# Altium project ESP32_P4_M3.PrjPcb (part 1 of 2)
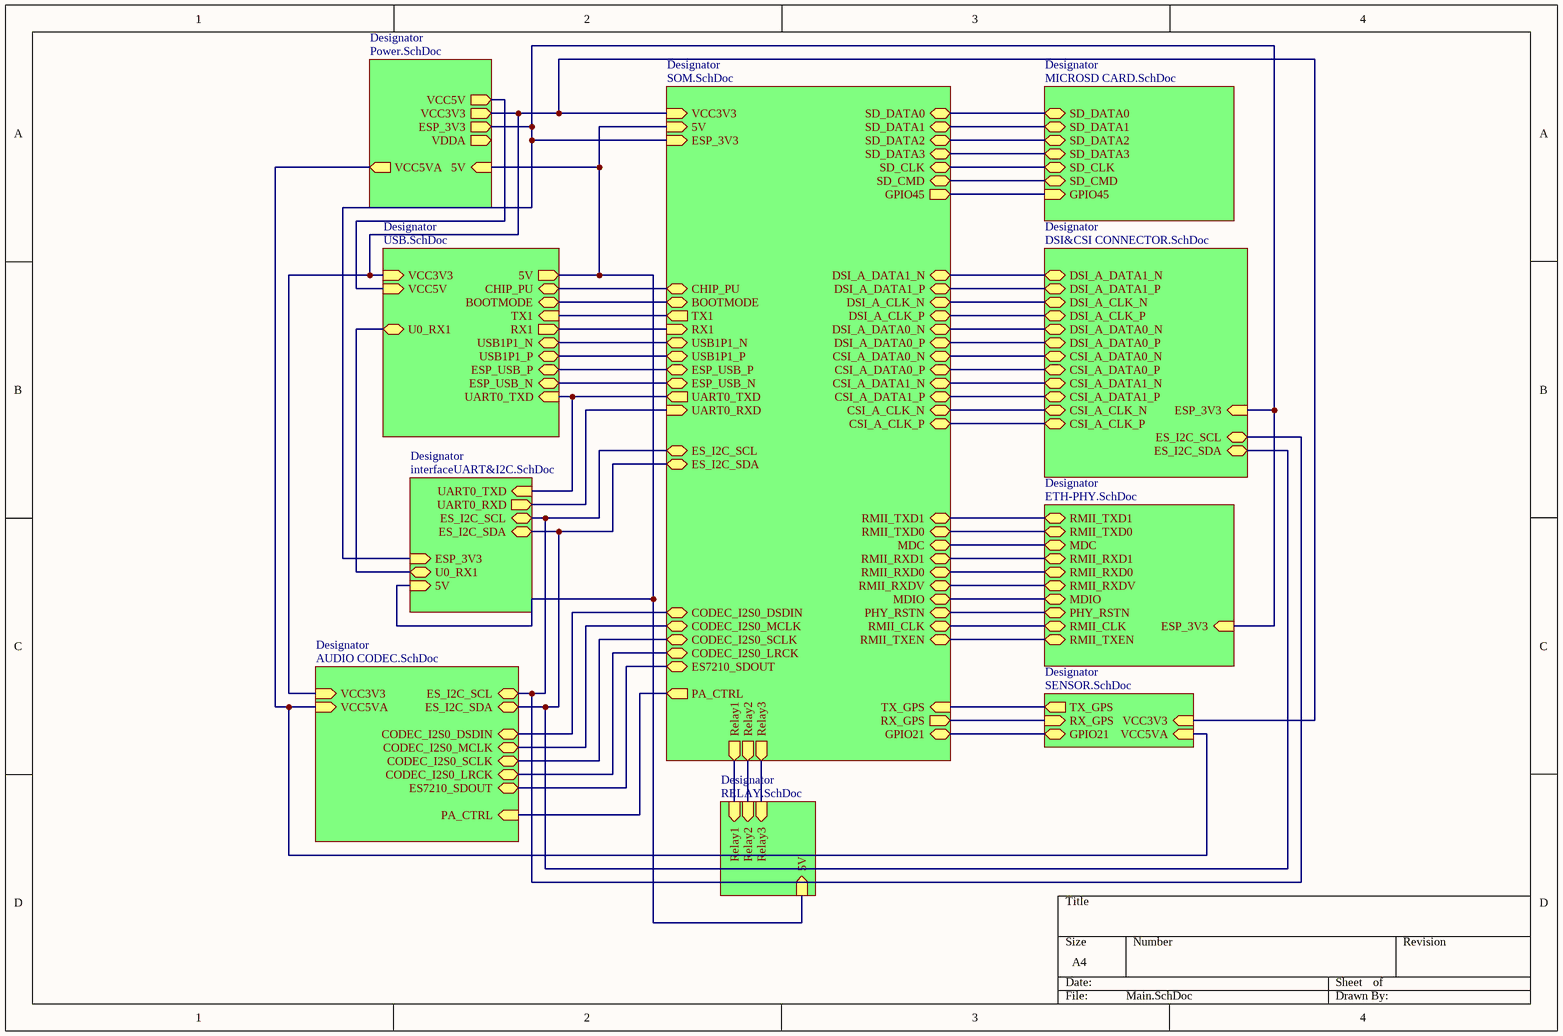
[diagram p0: Main.SchDoc]
11 sheets, 293 parts. Net scope: hierarchical (ports join the sheet entries above them; power ports are global).
Board file: ESP32_P4_M3.PcbDoc
Sheets:
  Main.SchDoc
    Designator = Power.SchDoc
    Designator = interfaceUART&I2C.SchDoc
    Designator = AUDIO CODEC.SchDoc
    Designator = MICROSD CARD.SchDoc
    Designator = USB.SchDoc
    Designator = DSI&CSI CONNECTOR.SchDoc
    Designator = ETH-PHY.SchDoc
    Designator = SOM.SchDoc
    Designator = SENSOR.SchDoc
    Designator = RELAY.SchDoc

## Sheet Main.SchDoc
size A4; Author: Qquoc; CompanyName: VKU; DrawnBy: Qquoc; Address1: AN NHƠN-BÌNH ĐỊNH; Revision: V1.0; SheetNumber: 1; SheetTotal: 11

### Sub-sheets
Designator = Power.SchDoc: VCC5V (out), VCC3V3 (out), ESP_3V3 (out), VDDA (out), VCC5VA (out), 5V (in)
Designator = interfaceUART&I2C.SchDoc: ESP_3V3 (in), UART0_TXD (in), UART0_RXD (out), ES_I2C_SCL (bidir), ES_I2C_SDA (bidir), U0_RX1 (bidir), 5V (in)
Designator = AUDIO CODEC.SchDoc: VCC5VA (in), PA_CTRL (in), CODEC_I2S0_SCLK (bidir), ES7210_SDOUT (bidir), CODEC_I2S0_LRCK (bidir), CODEC_I2S0_DSDIN (bidir), ES_I2C_SDA (bidir), ES_I2C_SCL (bidir), VCC3V3 (in), CODEC_I2S0_MCLK (bidir)
Designator = MICROSD CARD.SchDoc: GPIO45 (in), SD_DATA2 (bidir), SD_DATA3 (bidir), SD_CLK (bidir), SD_DATA0 (bidir), SD_DATA1 (bidir), SD_CMD (bidir)
Designator = USB.SchDoc: VCC3V3 (in), VCC5V (in), 5V (out), CHIP_PU (bidir), BOOTMODE (bidir), RX1 (out), TX1 (in), USB1P1_N (bidir), USB1P1_P (bidir), ESP_USB_P (bidir), ESP_USB_N (bidir), U0_RX1 (bidir), UART0_TXD (in)
Designator = DSI&CSI CONNECTOR.SchDoc: ES_I2C_SCL (bidir), ES_I2C_SDA (bidir), DSI_A_DATA1_N (bidir), DSI_A_DATA1_P (bidir), DSI_A_CLK_N (bidir), DSI_A_CLK_P (bidir), DSI_A_DATA0_N (bidir), DSI_A_DATA0_P (bidir), ESP_3V3 (in), CSI_A_DATA0_N (bidir), CSI_A_DATA0_P (bidir), CSI_A_DATA1_N (bidir), CSI_A_DATA1_P (bidir), CSI_A_CLK_N (bidir), CSI_A_CLK_P (bidir)
Designator = ETH-PHY.SchDoc: ESP_3V3 (in), RMII_TXEN (bidir), RMII_TXD0 (bidir), RMII_CLK (bidir), RMII_RXDV (bidir), RMII_RXD0 (bidir), RMII_RXD1 (bidir), MDC (bidir), PHY_RSTN (bidir), MDIO (bidir), RMII_TXD1 (bidir)
Designator = SOM.SchDoc: VCC3V3 (in), CHIP_PU (bidir), 5V (in), SD_DATA2 (bidir), SD_DATA3 (bidir), SD_CLK (bidir), SD_CMD (bidir), GPIO45 (out), SD_DATA1 (bidir), SD_DATA0 (bidir), UART0_RXD (in), UART0_TXD (out), BOOTMODE (bidir), RX1 (in), TX1 (out), USB1P1_P (bidir), USB1P1_N (bidir), ESP_USB_P (bidir), ESP_USB_N (bidir), CSI_A_DATA1_P (bidir), CSI_A_DATA1_N (bidir), CSI_A_CLK_N (bidir), CSI_A_CLK_P (bidir), CSI_A_DATA0_P (bidir), CSI_A_DATA0_N (bidir), DSI_A_DATA0_P (bidir), DSI_A_CLK_P (bidir), DSI_A_CLK_N (bidir), DSI_A_DATA1_P (bidir), DSI_A_DATA1_N (bidir), PA_CTRL (out), RMII_TXD1 (bidir), RMII_TXD0 (bidir), MDC (bidir), RMII_RXD1 (bidir), RMII_RXD0 (bidir), RMII_RXDV (bidir), MDIO (bidir), PHY_RSTN (bidir), RMII_CLK (bidir), RMII_TXEN (bidir), ES7210_SDOUT (bidir), CODEC_I2S0_DSDIN (bidir), CODEC_I2S0_MCLK (bidir), CODEC_I2S0_SCLK (bidir), CODEC_I2S0_LRCK (bidir), ES_I2C_SDA (bidir), ES_I2C_SCL (bidir), ESP_3V3 (in), DSI_A_DATA0_N (bidir), TX_GPS (in), RX_GPS (out), GPIO21 (bidir), Relay1 (out), Relay2 (out), Relay3 (out)
Designator = SENSOR.SchDoc: VCC3V3 (in), RX_GPS (in), TX_GPS (out), VCC5VA (in), GPIO21 (bidir)
Designator = RELAY.SchDoc: Relay1 (in), Relay3 (in), Relay2 (in), 5V (in)

### Nets
5V: sheet Designator/5V, sheet Designator/5V, sheet Designator/5V, sheet Designator/5V, sheet Designator/5V
ESP_3V3: sheet Designator/ESP_3V3, sheet Designator/ESP_3V3, sheet Designator/ESP_3V3, sheet Designator/ESP_3V3, sheet Designator/ESP_3V3
VCC3V3: sheet Designator/VCC3V3, sheet Designator/VDDA, sheet Designator/VCC3V3, sheet Designator/VCC3V3, sheet Designator/VCC3V3, sheet Designator/VCC3V3
VCC5V: sheet Designator/VCC5V, sheet Designator/VCC5V
VCC5VA: sheet Designator/VCC5VA, sheet Designator/VCC5VA, sheet Designator/VCC5VA
BOOTMODE: sheet Designator/BOOTMODE, sheet Designator/RMII_TXD1, sheet Designator/BOOTMODE, sheet Designator/RMII_TXD1
CHIP_PU: sheet Designator/CHIP_PU, sheet Designator/CHIP_PU
CODEC_I2S0_DSDIN: sheet Designator/CODEC_I2S0_DSDIN, sheet Designator/CODEC_I2S0_DSDIN
CODEC_I2S0_LRCK: sheet Designator/CODEC_I2S0_LRCK, sheet Designator/CODEC_I2S0_LRCK
CODEC_I2S0_MCLK: sheet Designator/CODEC_I2S0_MCLK, sheet Designator/CODEC_I2S0_MCLK
CODEC_I2S0_SCLK: sheet Designator/CODEC_I2S0_SCLK, sheet Designator/CODEC_I2S0_SCLK
CSI_A_CLK_N: sheet Designator/CSI_A_CLK_N, sheet Designator/CSI_A_CLK_N
CSI_A_CLK_P: sheet Designator/CSI_A_CLK_P, sheet Designator/CSI_A_CLK_P
CSI_A_DATA0_N: sheet Designator/CSI_A_DATA0_N, sheet Designator/CSI_A_DATA0_N
CSI_A_DATA0_P: sheet Designator/CSI_A_DATA0_P, sheet Designator/CSI_A_DATA0_P
CSI_A_DATA1_N: sheet Designator/CSI_A_DATA1_N, sheet Designator/CSI_A_DATA1_N
CSI_A_DATA1_P: sheet Designator/CSI_A_DATA1_P, sheet Designator/CSI_A_DATA1_P
DSI_A_CLK_N: sheet Designator/DSI_A_CLK_N, sheet Designator/DSI_A_CLK_N
DSI_A_CLK_P: sheet Designator/DSI_A_CLK_P, sheet Designator/DSI_A_CLK_P
DSI_A_DATA0_N: sheet Designator/DSI_A_DATA0_N, sheet Designator/DSI_A_DATA0_N
DSI_A_DATA0_P: sheet Designator/DSI_A_DATA0_P, sheet Designator/DSI_A_DATA0_P
DSI_A_DATA1_N: sheet Designator/DSI_A_DATA1_N, sheet Designator/DSI_A_DATA1_N
DSI_A_DATA1_P: sheet Designator/DSI_A_DATA1_P, sheet Designator/DSI_A_DATA1_P
ES7210_SDOUT: sheet Designator/ES7210_SDOUT, sheet Designator/ES7210_SDOUT
ES_I2C_SCL: sheet Designator/ES_I2C_SCL, sheet Designator/ES_I2C_SCL, sheet Designator/ES_I2C_SCL, sheet Designator/ES_I2C_SCL
ES_I2C_SDA: sheet Designator/ES_I2C_SDA, sheet Designator/ES_I2C_SDA, sheet Designator/ES_I2C_SDA, sheet Designator/ES_I2C_SDA
ESP_USB_N: sheet Designator/ESP_USB_N, sheet Designator/ESP_USB_N
ESP_USB_P: sheet Designator/ESP_USB_P, sheet Designator/ESP_USB_P
GPIO1: sheet Designator/Relay1, sheet Designator/Relay1
GPIO2: sheet Designator/Relay2, sheet Designator/Relay2
GPIO3: sheet Designator/Relay3, sheet Designator/Relay3
GPIO21: sheet Designator/GPIO21, sheet Designator/GPIO21
GPIO22: sheet Designator/TX_GPS, sheet Designator/TX_GPS
GPIO23: sheet Designator/RX_GPS, sheet Designator/RX_GPS
GPIO26: sheet Designator/TX1, sheet Designator/TX1
GPIO27: sheet Designator/RX1, sheet Designator/RX1
GPIO28: sheet Designator/RMII_RXDV, sheet Designator/RMII_RXDV
GPIO29: sheet Designator/RMII_RXD0, sheet Designator/RMII_RXD0
GPIO30: sheet Designator/RMII_RXD1, sheet Designator/RMII_RXD1
GPIO31: sheet Designator/MDC, sheet Designator/MDC
GPIO34: sheet Designator/RMII_TXD0, sheet Designator/RMII_TXD0
GPIO37: sheet Designator/UART0_TXD, sheet Designator/UART0_TXD, sheet Designator/UART0_TXD
GPIO38: sheet Designator/UART0_RXD, sheet Designator/UART0_RXD
GPIO45: sheet Designator/GPIO45, sheet Designator/GPIO45
GPIO49: sheet Designator/RMII_TXEN, sheet Designator/RMII_TXEN
GPIO50: sheet Designator/RMII_CLK, sheet Designator/RMII_CLK
GPIO51: sheet Designator/PHY_RSTN, sheet Designator/PHY_RSTN
GPIO52: sheet Designator/MDIO, sheet Designator/MDIO
SD_CLK: sheet Designator/SD_CLK, sheet Designator/SD_CLK
SD_CMD: sheet Designator/SD_CMD, sheet Designator/SD_CMD
SD_DATA0: sheet Designator/SD_DATA0, sheet Designator/SD_DATA0
SD_DATA1: sheet Designator/SD_DATA1, sheet Designator/SD_DATA1
SD_DATA2: sheet Designator/SD_DATA2, sheet Designator/SD_DATA2
SD_DATA3: sheet Designator/SD_DATA3, sheet Designator/SD_DATA3
U0_RX1: sheet Designator/U0_RX1, sheet Designator/U0_RX1
USB1P1_N: sheet Designator/USB1P1_N, sheet Designator/USB1P1_N
USB1P1_P: sheet Designator/USB1P1_P, sheet Designator/USB1P1_P
NetIC4_1: sheet Designator/PA_CTRL, sheet Designator/PA_CTRL

## Sheet Power.SchDoc
size A4; SheetNumber: 4; SheetTotal: 10
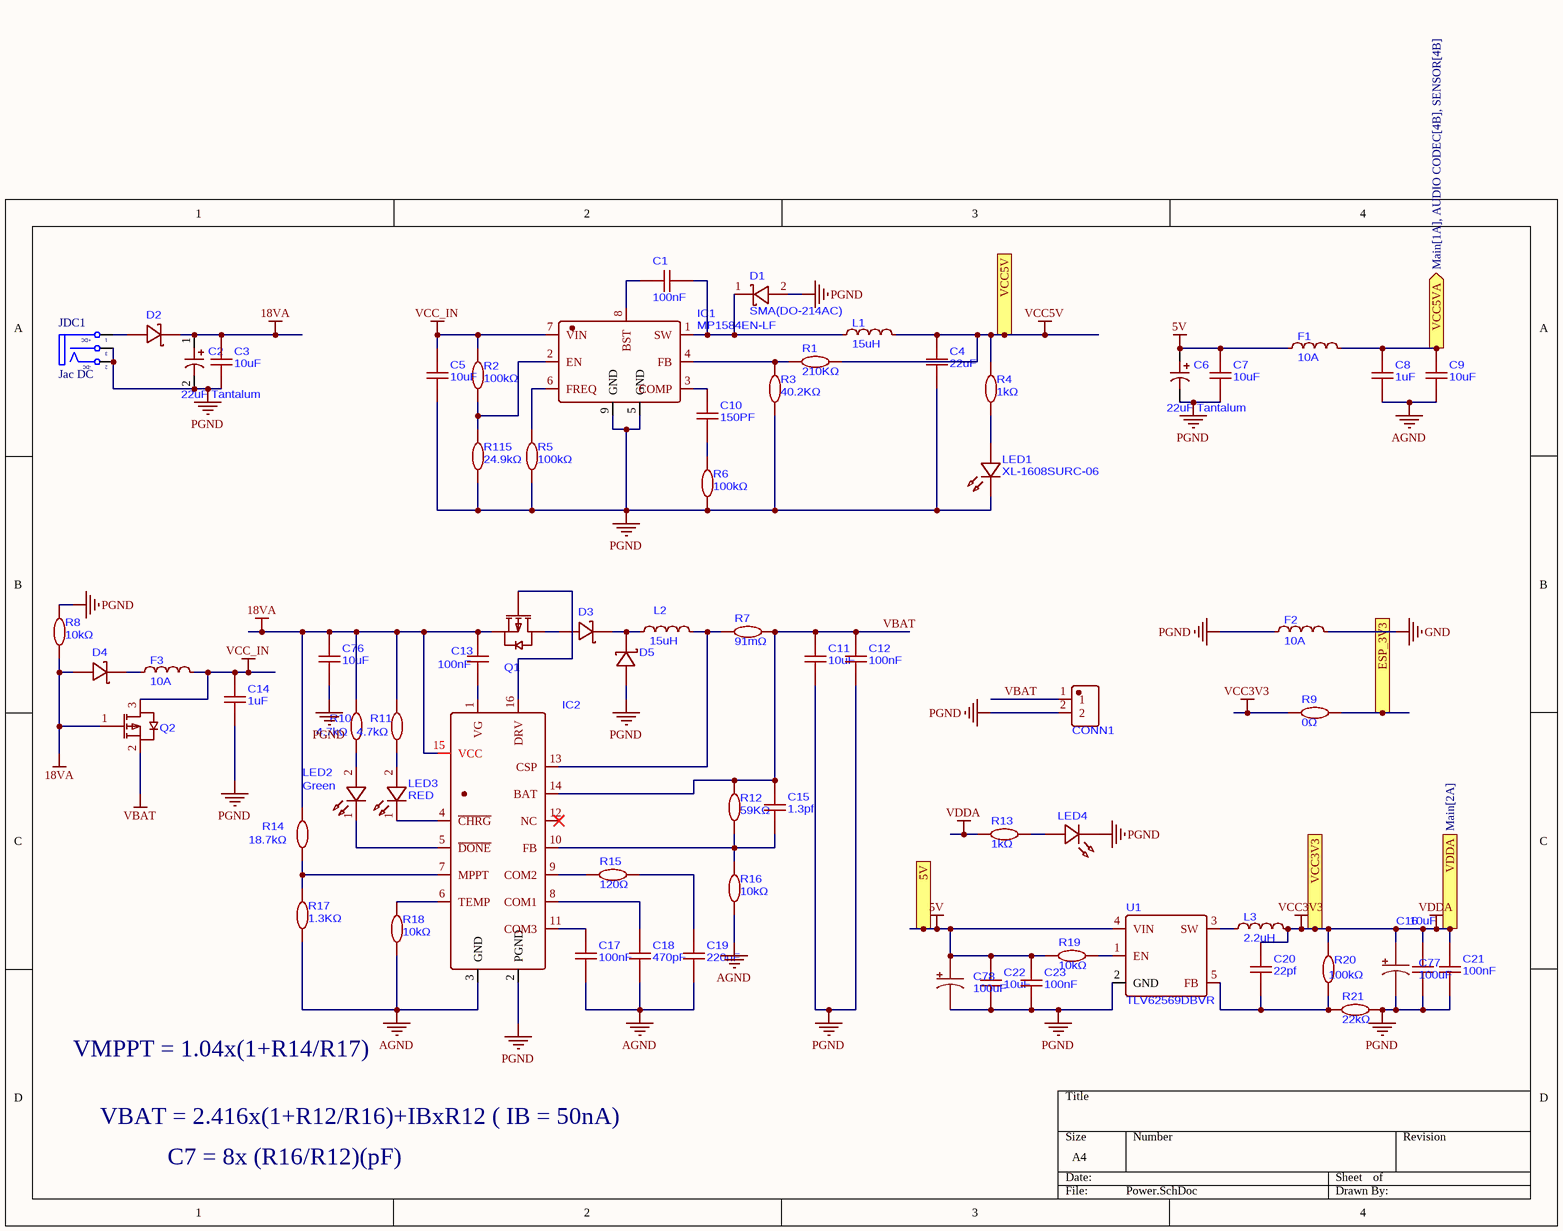
[diagram p1: Power.SchDoc]

### Parts
C1  100nF  [C0603]
C2  22uF Tantalum  [CAP-SMD_L7.3-W4.3-R-RD]
C3  10uF  [C0603]
C4  22uF  [C0603]
C5  10uF  [C0603]
C6  22uF Tantalum  [CAP-SMD_L7.3-W4.3-R-RD]
C7  10uF  [C0603]
C8  1uF  [C0603]
C9  10uF  [C0603]
C10  150PF  [C0603]
C11  10uF  [C0603]
C12  100nF  [C0603]
C13  100nF  [C0603]
C14  1uF  [C0603]
C15  1.3pf  [C0603]
C16  10uF  [C0603]
C17  100nF  [C0603]
C18  470pF  [C0603]
C19  220nF  [C0603]
C20  22pf  [C0603]
C21  100nF  [C0603]
C22  10uF  [C0603]
C23  100nF  [C0603]
C76  10uF  [C0603]
C77  100uF  [CAP-SMD_L3.5-W2.8-R-RD]
C78  100uF  [CAP-SMD_L3.5-W2.8-R-RD]
CONN1  TERM BLK 2POS 5mm TH  [CONN-TH_P5.00_KF128-5.0-2P]  (value not drawn)
D1  SMA(DO-214AC)  [SMA_L4.4-W2.6-LS5.0-RD]
D2  B540CQ-13-F  [SMC_L6.9-W5.9-LS7.9-RD]  (value not drawn)
D3  B540CQ-13-F  [SMC_L6.9-W5.9-LS7.9-RD]  (value not drawn)
D4  B540CQ-13-F  [SMC_L6.9-W5.9-LS7.9-RD]  (value not drawn)
D5  B540CQ-13-F  [SMC_L6.9-W5.9-LS7.9-RD]  (value not drawn)
F1  10A  [IND-SMD_L8.5-W3.1]
F2  10A  [IND-SMD_L8.5-W3.1]
F3  10A  [IND-SMD_L8.5-W3.1]
IC1  MP1584EN-LF  [SOIC-8_L4.9-W3.9-P1.27-LS6.0-BL-EP3.3]
IC2  5A TSSOP-16 Battery Management ROHS  [TSSOP-16_L5.0-W4.4-P0.65-LS6.4-BL]  (value not drawn)
JDC1  Jac DC  [DC-IN]
L1  15uH  [IND-SMD_L10.1-W10.0]
L2  15uH  [IND-SMD_L10.1-W10.0]
L3  2.2uH  [IND-SMD_L5.4-W5.2]
LED1  XL-1608SURC-06  [LED0603-RD_RED]
LED2  Green  [LED0603-RD_RED]
LED3  RED  [LED0603-RD_RED]
LED4  XL-1608SURC-06  [LED0603-RD_RED]  (value not drawn)
Q1  MOSFET P-CH 30V 4.3A SOT-23  [SOT-23-3_L2.9-W1.6-P1.90-LS2.8-BR]  (value not drawn)
Q2  MOSFET P-CH 30V 4.3A SOT-23  [SOT-23-3_L2.9-W1.6-P1.90-LS2.8-BR]  (value not drawn)
R1  210KΩ  [R0603]
R2  100kΩ  [R0603]
R3  40.2KΩ  [R0603]
R4  1kΩ  [R0603]
R5  100kΩ  [R0603]
R6  100kΩ  [R0603]
R7  91mΩ  [R1206]
R8  10kΩ  [R0603]
R9  0Ω  [R0603]
R10  4.7kΩ  [R0603]
R11  4.7kΩ  [R0603]
R12  59KΩ  [R0603]
R13  1kΩ  [R0603]
R14  18.7kΩ  [R0603]
R15  120Ω  [R0603]
R16  10kΩ  [R0603]
R17  1.3KΩ  [R0603]
R18  10kΩ  [R0603]
R19  10kΩ  [R0603]
R20  100kΩ  [R0603]
R21  22kΩ  [R0603]
R115  24.9kΩ  [R0603]
U1  TLV62569DBVR  [SOT-23-5_L3.0-W1.7-P0.95-LS2.8-BR]

### Ports
5V (in, see Main[2A], interfaceUART&I2C[2B], RELAY[1A], SOM[3A], USB[2D]), ESP_3V3 (out, see Main[2A], DSI&CSI CONNECTOR[3C], ETH-PHY[2A], interfaceUART&I2C[1C], SOM[6B]), VCC3V3 (out, see Main[2A], AUDIO CODEC[2C], SENSOR[3A], SOM[4A], USB[4C]), VCC5V (out, see Main[2A], USB[1D]), VCC5VA (out, see Main[1A], AUDIO CODEC[4B], SENSOR[4B]), VDDA (out, see Main[2A])

### Nets
5V: C6.1 C7.2 C22.2 C23.2 C78.1 F1.1 R19.1 U1.4(VIN) ; port 5V
18VA: C2.1 C3.2 C13.2 C76.2 D2.1(C) D4.2(A) IC2.15(VCC) Q1.2(S) Q2.1(G) R8.1 R10.2 R11.2 R14.2
AGND: C8.2 C9.1 C17.1 C18.1 C19.1 IC2.3(GND) R16.1 R17.1 R18.1
ESP_3V3: R9.2 ; port ESP_3V3
GND: F2.2
PGND: C2.2 C3.1 C4.1 C5.1 C6.2 C7.1 C11.1 C12.1 C14.2 C16.1 C21.1 C22.1 C23.1 C76.1 C77.2 C78.2 CONN1.2 D1.2(A) D5.2(A) F2.1 IC1.5(GND) IC1.9(GND) IC2.2(PGND) JDC1.2(TN) JDC1.3(S) LED1.1(K) LED4.1(K) R3.1 R5.1 R6.1 R8.2 R21.2 R115.1 U1.2(GND)
VBAT: C11.2 C12.2 C15.2 CONN1.1 IC2.14(BAT) Q2.2(S) R7.2 R12.2
VCC3V3: C16.2 C20.2 C21.2 C77.1 L3.2 R9.1 R13.2 R20.2 ; port VCC3V3, port VDDA  [also labelled VDDA]
VCC5V: C4.2 L1.2 R1.2 R4.2 ; port VCC5V
VCC5VA: C8.1 C9.2 F1.2 ; port VCC5VA
VCC_IN: C5.2 C14.1 F3.2 IC1.7(VIN) Q2.3(D) R2.2
NetC1_1: C1.1 IC1.8(BST)
NetC1_2: C1.2 D1.1(K) IC1.1(SW) L1.1
NetC10_1: C10.1 R6.2
NetC10_2: C10.2 IC1.3(COMP)
NetC13_1: C13.1 IC2.1(VG)
NetC15_1: C15.1 IC2.10(FB) R12.1 R16.2
NetC17_2: C17.2 IC2.11(COM3)
NetC18_2: C18.2 IC2.8(COM1)
NetC19_2: C19.2 R15.2
NetC20_1: C20.1 R20.1 R21.1 U1.5(FB)
NetD2_2: D2.2(A) JDC1.1(T)
NetD3_1: D3.1(C) D5.1(C) L2.1
NetD3_2: D3.2(A) Q1.3(D)
NetD4_1: D4.1(C) F3.1
NetIC1_2: IC1.2(EN) R2.1 R115.2
NetIC1_4: IC1.4(FB) R1.1 R3.2
NetIC1_6: IC1.6(FREQ) R5.2
NetIC2_4: IC2.4(~{CHRG}) LED3.1(K)
NetIC2_5: IC2.5(~{DONE}) LED2.1(K)
NetIC2_6: IC2.6(TEMP) R18.2
NetIC2_7: IC2.7(MPPT) R14.1 R17.2
NetIC2_9: IC2.9(COM2) R15.1
NetIC2_13: IC2.13(CSP) L2.2 R7.1
NetIC2_16: IC2.16(DRV) Q1.1(G)
NetL3_1: L3.1 U1.3(SW)
NetLED1_2: LED1.2(A) R4.1
NetLED2_2: LED2.2(A) R10.1
NetLED3_2: LED3.2(A) R11.1
NetLED4_2: LED4.2(A) R13.1
NetR19_2: R19.2 U1.1(EN)

Not connected (* = marked no-connect by the designer): IC2 12(NC)*

### Notes on the sheet
- VMPPT = 1.04x(1+R14/R17)
- VBAT = 2.416x(1+R12/R16)+IBxR12 ( IB = 50nA)
- C7 = 8x (R16/R12)(pF)
- (in symbol DCIN) +DC; -DC

### Library data of the parts
C1 C12 C13 C17 C21 C23 = CC0603KRX7R9BB104: 50V 100nF X7R ±10% 0603 Ceramic Capacitors ROHS
C2 C6 = T491X226K050AT: CAP TANT 22uF ±10% 50V CASE-X-7343-43(mm)
C3 C5 C7 C9 C11 C76 = CL10A106MA8NRNC: 25V 10uF X5R ±20% 0603 Ceramic Capacitors ROHS
C4 = CL10A226MP8NUNE: 10V 22uF X5R ±20% 0603 Ceramic Capacitors ROHS
C8 C14 = CL10B105KA8NNNC: 25V 1uF X7R ±10% 0603 Ceramic Capacitors ROHS
C10 = CC0603JRNPO9BN151: 50V 150pF NP0 ±5% 0603 Ceramic Capacitors ROHS
C15 = CC0603CRNPO9BN1R3: 50V 1.3pF NP0 0603 Ceramic Capacitors ROHS
C16 C22 = CL10A106KP8NNNC: 10V 10uF X5R ±10% 0603 Ceramic Capacitors ROHS
C18 = CL10C471JB8NNNC: 50V 470pF C0G ±5% 0603 Ceramic Capacitors ROHS
C19 = CL10B224KB8NNNC: 50V 220nF X7R ±10% 0603 Ceramic Capacitors ROHS
C20 = CL10C220JB8NNNC: 50V 22pF C0G ±5% 0603 Ceramic Capacitors RoHS
C77 C78 = CA45A-B-10V-100UF-K: 100uF 10V ±10% CASE-B-3528-19(mm) Tantalum Capacitors RoHS
CONN1 = KF128-5.0-2P: 2.5 1x2P 12~22 Green 24A -40℃~+105℃ 250V Through Hole 5mm 1 2 Through Hole,P=5mm Wire to Board RoHS
D1 = B340A-13-F: 80A 40V 500mV@3A 3A SMA(DO-214AC) Single Diodes ROHS
D2-D5 = B540CQ-13-F: 40V 550mV@5A 5A SMC(DO-214AB) Single Diodes ROHS
F1-F3 = HI3312X101R-10: 4mΩ 100Ω@100MHz SMD,8.5x3.1mm Ferrite Beads and Chips ROHS
IC1 = MP1584EN-LF: Buck Switching Regulator IC
IC2 = CN3722: Multi-type battery charging management integrated circuit with maximum power point tracking function for solar cells
JDC1 = DCIN: Jac DC input; Value: Jac DC
L1 L2 = YDRH105R-150M: 3.4A 15uH Magnetic Shielded Inductor ±20% 41mΩ SMD,10.1x10.1mm Fixed Inductors ROHS
L3 = APH0530T2R2M: 7A 2.2uH Molded Inductor ±20% 7A 29mΩ SMD,5.4x5.2mm Fixed Inductors RoHS
LED1 LED3 LED4 = XL-1608SURC-06: 20mA 2.3V Red 50mW 0603 LED Indication - Discrete ROHS
LED2 = D-060306G1/SS2/G1: 5mA 500mcd 526nm~532nm Green 70mW 2.8V 0603 LED Indication - Discrete ROHS
Q1 Q2 = AO3407A: 30V 4.3A 48mΩ@10V 2.5V@250uA 1 P-Channel SOT-23 Single FETs, MOSFETs ROHS
R1 = 0603WAF2103T5E: 100mW 210kΩ 75V ±100ppm/℃ Thick Film Resistor ±1% 0603 Chip Resistor - Surface Mount ROHS
R2 R5 R6 R20 = RC0603FR-07100KL: 100mW 100kΩ 75V ±100ppm/℃ Thick Film Resistor ±1% 0603 Chip Resistor - Surface Mount ROHS
R3 = RT0603BRD0740K2L: 40.2kΩ 100mW 75V ±25ppm/℃ Thin Film Resistor ±0.1% 0603 Chip Resistor - Surface Mount ROHS
R4 R13 = RMC 0603 1K J N: 100mW 1kΩ 50V ±100ppm/℃ Thick Film Resistor ±5% 0603 Chip Resistor - Surface Mount ROHS
R7 = FRL1206FR091TS: 250mW 91mΩ 500V ±600ppm/℃ Thick Film Resistor ±1% 1206 Chip Resistor - Surface Mount ROHS
R8 R16 R18 R19 = RC0603FR-0710KL: 100mW 10kΩ 75V ±100ppm/℃ Thick Film Resistor ±1% 0603 Chip Resistor - Surface Mount ROHS
R9 = RC0603JR-070RL: 100mW 0Ω 75V Thick Film Resistor ±5% 0603 Chip Resistor - Surface Mount RoHS
R10 R11 = RC0603FR-074K7L: 100mW 4.7kΩ 75V ±100ppm/℃ Thick Film Resistor ±1% 0603 Chip Resistor - Surface Mount ROHS
R12 = FRC0603F5902TS: 100mW 59kΩ 75V ±100ppm/℃ Thick Film Resistor ±1% 0603 Chip Resistor - Surface Mount ROHS
R14 = FRC0603F1872TS: 100mW 18.7kΩ 75V ±100ppm/℃ Thick Film Resistor ±1% 0603 Chip Resistor - Surface Mount ROHS
R15 = 0603WAF1200T5E: 100mW 120Ω 75V ±100ppm/℃ Thick Film Resistor ±1% 0603 Chip Resistor - Surface Mount ROHS
R17 = RT0603BRD071K3L: 100mW 1.3kΩ 75V ±25ppm/℃ Thin Film Resistor ±0.1% 0603 Chip Resistor - Surface Mount ROHS
R21 = RC0603FR-0722KL: 100mW 22kΩ 75V ±100ppm/℃ Thick Film Resistor ±1% 0603 Chip Resistor - Surface Mount RoHS
R115 = 0603WAF2492T5E: 1100mW 24.9kΩ 75V ±100ppm/℃ Thick Film Resistor ±1% 0603 Chip Resistor - Surface Mount ROHS
U1 = TLV62569DBVR: 1.5MHz 2A Buck Adjustable 600mV~5.5V 1 SOT-23-5 Voltage Regulators - DC DC Switching Regulators RoHS

## Sheet interfaceUART&I2C.SchDoc
size A; SheetNumber: 3; SheetTotal: 10
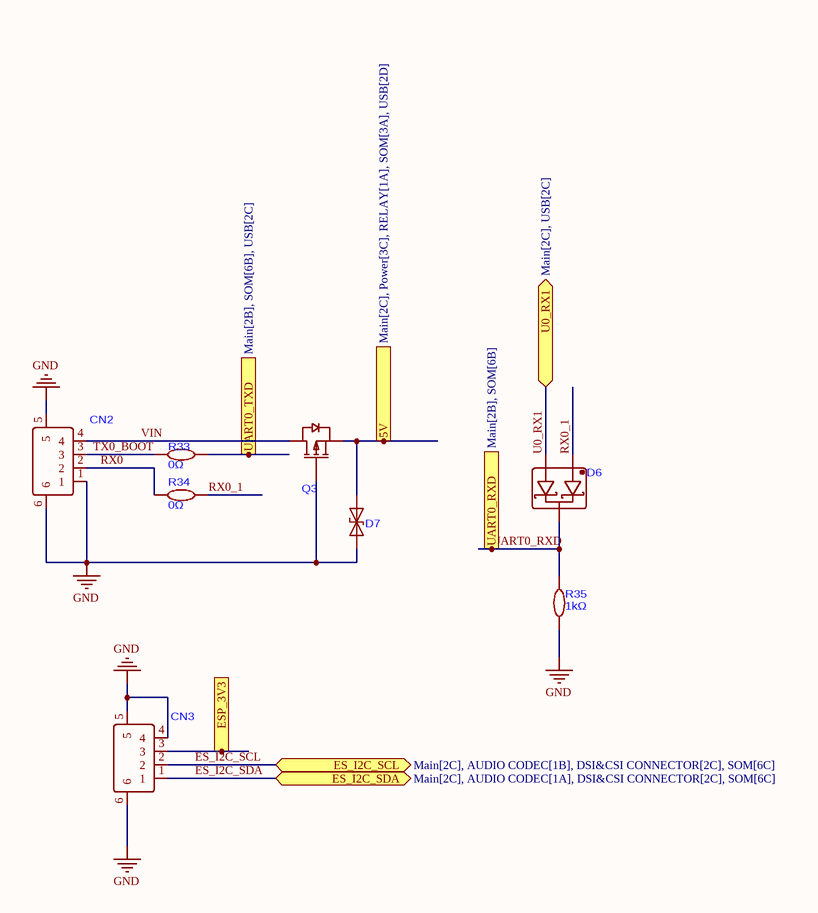
[diagram p2: interfaceUART&I2C.SchDoc]

### Parts
CN2  533980471  [CONN-SMD_4P-P1.25_XUNPU_WAFER-GH1.25-4PWB]  (value not drawn)
CN3  533980471  [CONN-SMD_4P-P1.25_XUNPU_WAFER-GH1.25-4PWB]  (value not drawn)
D6  DIODE ARR SCHOTTKY 30V SOT-23  [SOT-23-3_L2.9-W1.3-P1.90-LS2.4-BR]  (value not drawn)
D7  TVS DIODE 5VWM 9.2VC DO-214AA  [SMB_L4.6-W3.6-LS5.3-BI]  (value not drawn)
Q3  MOSFET P-CH 30V 4.3A SOT-23  [SOT-23-3_L2.9-W1.6-P1.90-LS2.8-BR]  (value not drawn)
R33  0Ω  [R0603]
R34  0Ω  [R0603]
R35  1kΩ  [R0603]

### Ports
5V (in, see Main[2C], Power[3C], RELAY[1A], SOM[3A], USB[2D]), ES_I2C_SCL (bidir, see Main[2C], AUDIO CODEC[1B], DSI&CSI CONNECTOR[2C], SOM[6C]), ES_I2C_SDA (bidir, see Main[2C], AUDIO CODEC[1A], DSI&CSI CONNECTOR[2C], SOM[6C]), ESP_3V3 (in, see Main[2C], DSI&CSI CONNECTOR[3C], ETH-PHY[2A], Power[4C], SOM[6B]), U0_RX1 (bidir, see Main[2C], USB[2C]), UART0_RXD (out, see Main[2B], SOM[6B]), UART0_TXD (in, see Main[2B], SOM[6B], USB[2C])

### Nets
5V: D7.2(A) Q3.2(S) ; port 5V
ESP_3V3: CN3.3 ; port ESP_3V3
GND: CN2.1 CN2.5 CN2.6 CN3.4 CN3.5 CN3.6 D7.1(K) Q3.1(G) R35.1
ES_I2C_SCL: CN3.2 ; port ES_I2C_SCL
ES_I2C_SDA: CN3.1 ; port ES_I2C_SDA
GPIO37: R33.2 ; port UART0_TXD
RX0: CN2.2 R34.1
RX0_1: D6.1 R34.2
TX0_BOOT: CN2.3 R33.1
U0_RX1: D6.2 ; port U0_RX1
UART0_RXD: D6.3 R35.2 ; port UART0_RXD  [project net GPIO38]
VIN: CN2.4 Q3.3(D)

### Library data of the parts
CN2 CN3 = 533980471: 4P PicoBlade(MX 1.25) 1x4P Tin -40℃~+105℃ White 1.25mm 125V 4 1A 1 Surface Mount,Vertical SMD,P=1.25mm Headers, Male Pins RoHS
D6 = BAT54C_C916424: 600mA 30V 1 Pair Common Cathode 1V@100mA 200mA SOT-23 Single Diodes RoHS
D7 = SMBJ5.0CA_C83323: 65.3A 600W 9.2V 6.4V Bidirectional 5V DO-214AA TVS Diodes RoHS
Q3 = AO3407A: as Q1 on sheet Power
R33 R34 = RC0603JR-070RL: as R9 on sheet Power
R35 = RMC 0603 1K J N: as R4 on sheet Power

## Sheet AUDIO CODEC.SchDoc
size A4; SheetNumber: 2; SheetTotal: 11
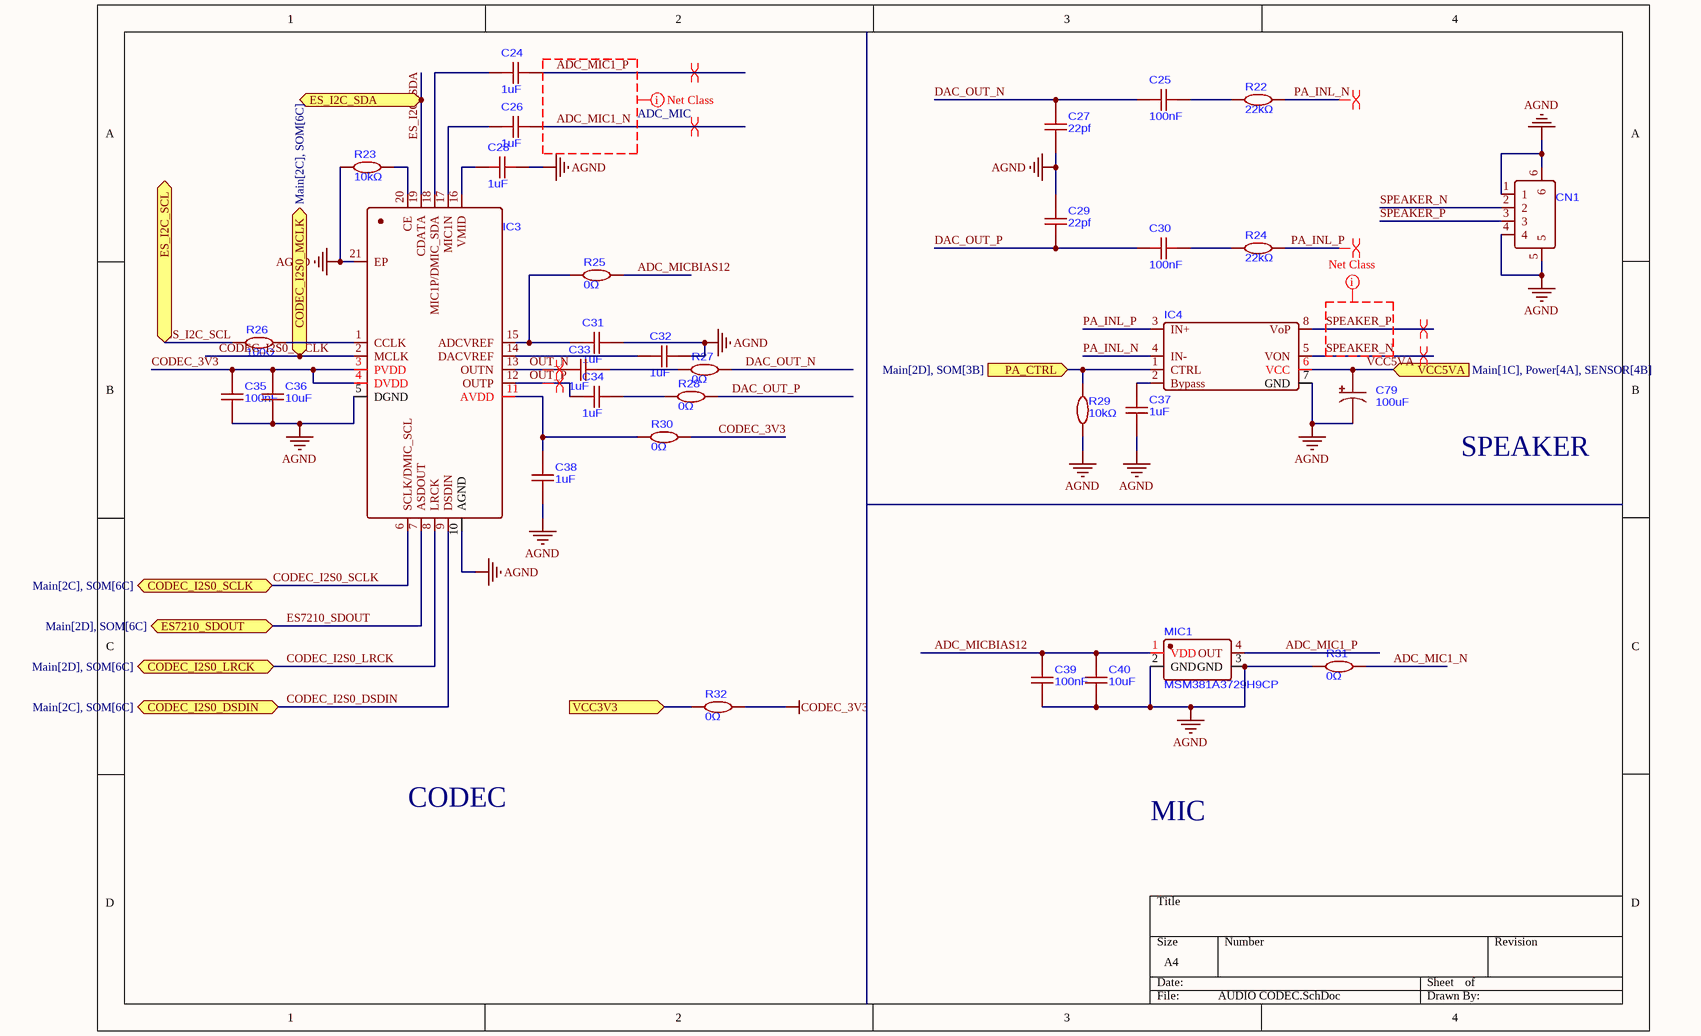
[diagram p3: AUDIO CODEC.SchDoc]

### Parts
C24  1uF  [C0603]
C25  100nF  [C0603]
C26  1uF  [C0603]
C27  22pf  [C0603]
C28  1uF  [C0603]
C29  22pf  [C0603]
C30  100nF  [C0603]
C31  1uF  [C0603]
C32  1uF  [C0603]
C33  1uF  [C0603]
C34  1uF  [C0603]
C35  100nF  [C0603]
C36  10uF  [C0603]
C37  1uF  [C0603]
C38  1uF  [C0603]
C39  100nF  [C0603]
C40  10uF  [C0603]
C79  100uF  [CAP-SMD_L3.5-W2.8-R-RD]
CN1  533980471  [CONN-SMD_4P-P1.25_XUNPU_WAFER-GH1.25-4PWB]  (value not drawn)
IC3  Low Power Mono Audio CODEC  [WQFN-20_L3.0-W3.0-P0.40-BL-EP1.7]  (value not drawn)
IC4  NS4150B 3.0W Mono Class-D Audio Power Amplifier  [MSOP-8_L3.0-W3.0-P0.65-LS5.0-BL]  (value not drawn)
MIC1  MSM381A3729H9CP  [MIC-SMD_4P-L3.8-W3.0-P2.46-S1.70-TR]
R22  22kΩ  [R0603]
R23  10kΩ  [R0603]
R24  22kΩ  [R0603]
R25  0Ω  [R0603]
R26  100Ω  [R0603]
R27  0Ω  [R0603]
R28  0Ω  [R0603]
R29  10kΩ  [R0603]
R30  0Ω  [R0603]
R31  0Ω  [R0603]
R32  0Ω  [R0603]

### Ports
CODEC_I2S0_DSDIN (bidir, see Main[2C], SOM[6C]), CODEC_I2S0_LRCK (bidir, see Main[2D], SOM[6C]), CODEC_I2S0_MCLK (bidir, see Main[2C], SOM[6C]), CODEC_I2S0_SCLK (bidir, see Main[2C], SOM[6C]), ES7210_SDOUT (bidir, see Main[2D], SOM[6C]), ES_I2C_SCL (bidir, see Main[2C], DSI&CSI CONNECTOR[2C], interfaceUART&I2C[2C], SOM[6C]), ES_I2C_SDA (bidir, see Main[2C], DSI&CSI CONNECTOR[2C], interfaceUART&I2C[2C], SOM[6C]), PA_CTRL (in, see Main[2D], SOM[3B]), VCC3V3 (in, see Main[1C], Power[4C], SENSOR[3A], SOM[4A], USB[4C]), VCC5VA (in, see Main[1C], Power[4A], SENSOR[4B])

### Nets
AGND: C27.1 C28.1 C29.2 C31.1 C32.1 C35.1 C36.1 C37.1 C38.2 C39.1 C40.1 C79.2 CN1.1 CN1.4 CN1.5 CN1.6 IC3.5(DGND) IC3.10(AGND) IC3.21(EP) IC4.7(GND) MIC1.2(GND) MIC1.3(GND) R23.1 R29.1 R31.1
CODEC_3V3: C35.2 C36.2 IC3.3(PVDD) IC3.4(DVDD) R30.2 R32.2
VCC3V3: R32.1 ; port VCC3V3
VCC5VA: C79.1 IC4.6(VCC) ; port VCC5VA
ADC_MIC1_N: C26.1 R31.2
ADC_MIC1_P: C24.2 MIC1.4(OUT)
ADC_MICBIAS12: C39.2 C40.2 MIC1.1(VDD) R25.2
CODEC_I2S0_DSDIN: IC3.9(DSDIN) ; port CODEC_I2S0_DSDIN
CODEC_I2S0_LRCK: IC3.8(LRCK) ; port CODEC_I2S0_LRCK
CODEC_I2S0_MCLK: IC3.2(MCLK) ; port CODEC_I2S0_MCLK
CODEC_I2S0_SCLK: IC3.6(SCLK/DMIC_SCL) ; port CODEC_I2S0_SCLK
DAC_OUT_N: C25.1 C27.2 R27.2
DAC_OUT_P: C29.1 C30.1 R28.2
ES7210_SDOUT: IC3.7(ASDOUT) ; port ES7210_SDOUT
ES_I2C_SCL: R26.1 ; port ES_I2C_SCL
ES_I2C_SDA: IC3.19(CDATA) ; port ES_I2C_SDA
OUT_N: C33.2 IC3.13(OUTN)
OUT_P: C34.2 IC3.12(OUTP)
PA_INL_N: IC4.4(IN-) R22.2
PA_INL_P: IC4.3(IN+) R24.2
SPEAKER_N: CN1.2 IC4.5(VON)
SPEAKER_P: CN1.3 IC4.8(VoP)
NetC24_1: C24.1 IC3.18(MIC1P/DMIC_SDA)
NetC25_2: C25.2 R22.1
NetC26_2: C26.2 IC3.17(MIC1N)
NetC28_2: C28.2 IC3.16(VMID)
NetC30_2: C30.2 R24.1
NetC31_2: C31.2 IC3.15(ADCVREF) R25.1
NetC32_2: C32.2 IC3.14(DACVREF)
NetC33_1: C33.1 R27.1
NetC34_1: C34.1 R28.1
NetC37_2: C37.2 IC4.2(Bypass)
NetC38_1: C38.1 IC3.11(AVDD) R30.1
NetIC3_1: IC3.1(CCLK) R26.2
NetIC3_20: IC3.20(CE) R23.2
NetIC4_1: IC4.1(CTRL) R29.2 ; port PA_CTRL

### Layout directives
net class ADC_MIC: ADC_MIC1_N, ADC_MIC1_P
differential pair; net class DIFF; differential pair class DIFF: ADC_MIC1_N, ADC_MIC1_P, OUT_N, OUT_P, PA_INL_N, PA_INL_P, SPEAKER_N, SPEAKER_P
net class SPEAKER: SPEAKER_N, SPEAKER_P

### Notes on the sheet
- SPEAKER
- CODEC
- MIC

### Library data of the parts
C24 C26 C28 C31-C34 C37 C38 = CL10B105KA8NNNC: as C8 on sheet Power
C25 C30 C35 C39 = CC0603KRX7R9BB104: as C1 on sheet Power
C27 C29 = CL10C220JB8NNNC: as C20 on sheet Power
C36 C40 = CL10A106MA8NRNC: as C3 on sheet Power
C79 = CA45A-B-10V-100UF-K: as C77 on sheet Power
CN1 = 533980471: as CN2 on sheet interfaceUART&I2C
IC3 = ES8311: 1.8V~3.3V QFN-20-EP(3x3) Signal Switches, Multiplexers, Decoders RoHS
IC4 = NS4150: 4mA 1-Channel 3Wx1@4Ω Class D MSOP-8 Audio Amplifiers RoHS
MIC1 = MSM381A3729H9CP: OCLGA-4(3x3.8) MEMS Microphones ROHS
R22 R24 = RC0603FR-0722KL: as R21 on sheet Power
R23 R29 = RC0603FR-0710KL: as R8 on sheet Power
R25 R27 R28 R30-R32 = RC0603JR-070RL: as R9 on sheet Power
R26 = RC0603FR-07100RL: 100mW 100Ω 75V ±100ppm/℃ Thick Film Resistor ±1% 0603 Chip Resistor - Surface Mount ROHS

## Sheet MICROSD CARD.SchDoc
size A4; SheetNumber: 4; SheetTotal: 11
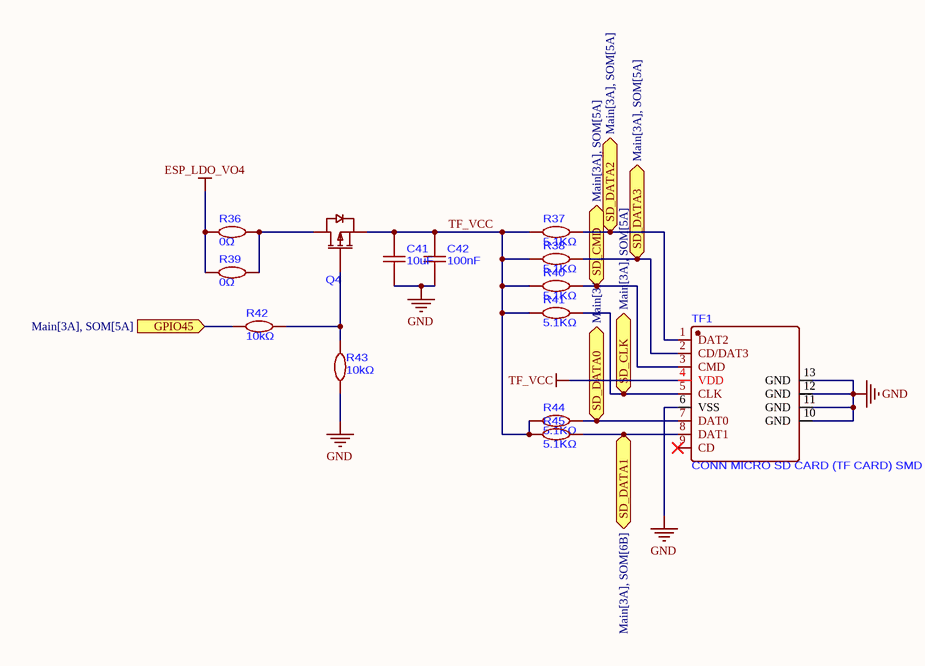
[diagram p4: MICROSD CARD.SchDoc]

### Parts
C41  10uF  [C0603]
C42  100nF  [C0603]
Q4  MOSFET P-CH 30V 4.3A SOT-23  [SOT-23-3_L2.9-W1.6-P1.90-LS2.8-BR]  (value not drawn)
R36  0Ω  [R0603]
R37  5.1KΩ  [R0603]
R38  5.1KΩ  [R0603]
R39  0Ω  [R0603]
R40  5.1KΩ  [R0603]
R41  5.1KΩ  [R0603]
R42  10kΩ  [R0603]
R43  10kΩ  [R0603]
R44  5.1KΩ  [R0603]
R45  5.1KΩ  [R0603]
TF1  CONN MICRO SD CARD (TF CARD) SMD  [TF-SMD_SH_SH-TF-01A]

### Ports
GPIO45 (in, see Main[3A], SOM[5A]), SD_CLK (bidir, see Main[3A], SOM[5A]), SD_CMD (bidir, see Main[3A], SOM[5A]), SD_DATA0 (bidir, see Main[3A], SOM[6B]), SD_DATA1 (bidir, see Main[3A], SOM[6B]), SD_DATA2 (bidir, see Main[3A], SOM[5A]), SD_DATA3 (bidir, see Main[3A], SOM[5A])

### Nets
ESP_LDO_VO4: R36.1 R39.1
GND: C41.1 C42.1 R43.1 TF1.6(VSS) TF1.10(GND) TF1.11(GND) TF1.12(GND) TF1.13(GND)
TF_VCC: C41.2 C42.2 Q4.2(S) R37.1 R38.1 R40.1 R41.1 R44.1 R45.1 TF1.4(VDD)
GPIO45: R42.2 ; port GPIO45
SD_CLK: R41.2 TF1.5(CLK) ; port SD_CLK
SD_CMD: R40.2 TF1.3(CMD) ; port SD_CMD
SD_DATA0: R44.2 TF1.7(DAT0) ; port SD_DATA0
SD_DATA1: R45.2 TF1.8(DAT1) ; port SD_DATA1
SD_DATA2: R37.2 TF1.1(DAT2) ; port SD_DATA2
SD_DATA3: R38.2 TF1.2(CD/DAT3) ; port SD_DATA3
NetQ4_1: Q4.1(G) R42.1 R43.2
NetQ4_3: Q4.3(D) R36.2 R39.2

Not connected (* = marked no-connect by the designer): TF1 9(CD)*

### Library data of the parts
C41 = CL10A106MA8NRNC: as C3 on sheet Power
C42 = CC0603KRX7R9BB104: as C1 on sheet Power
Q4 = AO3407A: as Q1 on sheet Power
R36 R39 = RC0603JR-070RL: as R9 on sheet Power
R37 R38 R40 R41 R44 R45 = FRC0603F5101TS: 100mW 5.1kΩ 75V ±100ppm/℃ Thick Film Resistor ±1% 0603 Chip Resistor - Surface Mount RoHS
R42 R43 = RC0603FR-0710KL: as R8 on sheet Power
TF1 = SH-TF-01A: -25℃~+85℃ Push-Push 2mm Connector and Ejector MicroSD Card (TF Card) SMD PC Card Sockets RoHS

## Sheet USB.SchDoc
size A3; SheetNumber: 6; SheetTotal: 11
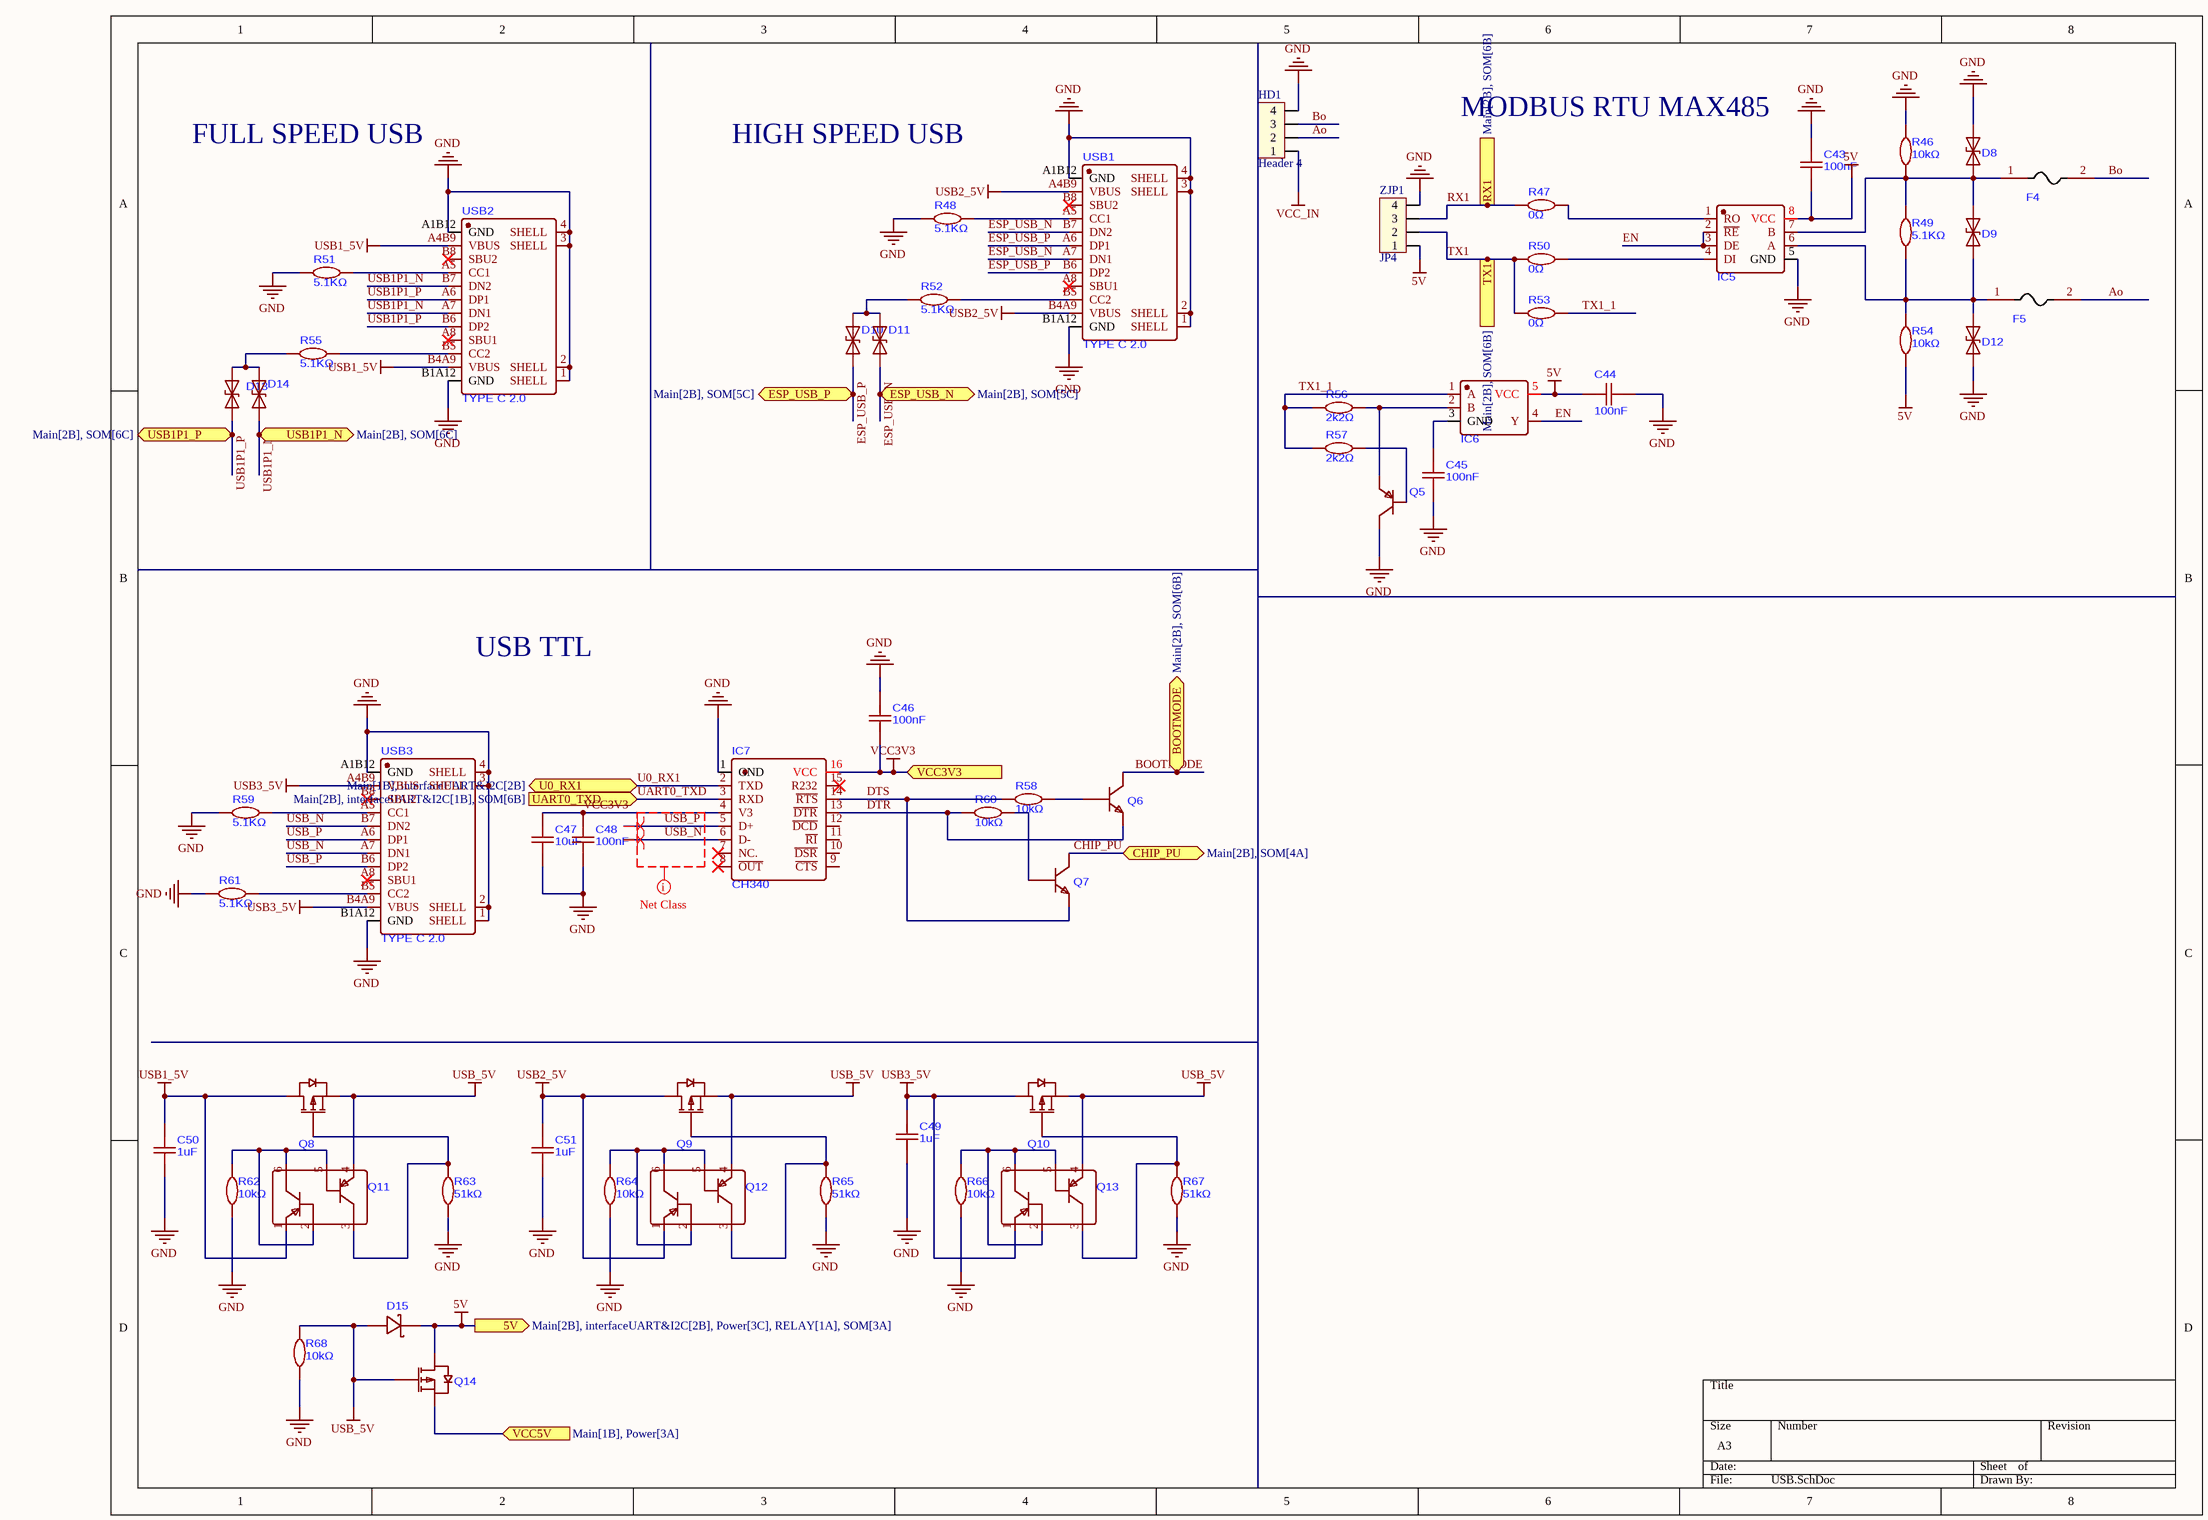
[diagram p5: USB.SchDoc]

### Parts
C43  100nF  [C0603]
C44  100nF  [C0603]
C45  100nF  [C0603]
C46  100nF  [C0603]
C47  10uF  [C0603]
C48  100nF  [C0603]
C49  1uF  [C0603]
C50  1uF  [C0603]
C51  1uF  [C0603]
D8  TVS DIODE 5VWM 18.6VC SOD-523  [SOD-523_L1.2-W0.8-LS1.6-BI]  (value not drawn)
D9  TVS DIODE 5VWM 18.6VC SOD-523  [SOD-523_L1.2-W0.8-LS1.6-BI]  (value not drawn)
D10  TVS DIODE 5VWM 18.6VC SOD-523  [SOD-523_L1.2-W0.8-LS1.6-BI]  (value not drawn)
D11  TVS DIODE 5VWM 18.6VC SOD-523  [SOD-523_L1.2-W0.8-LS1.6-BI]  (value not drawn)
D12  TVS DIODE 5VWM 18.6VC SOD-523  [SOD-523_L1.2-W0.8-LS1.6-BI]  (value not drawn)
D13  TVS DIODE 5VWM 18.6VC SOD-523  [SOD-523_L1.2-W0.8-LS1.6-BI]  (value not drawn)
D14  TVS DIODE 5VWM 18.6VC SOD-523  [SOD-523_L1.2-W0.8-LS1.6-BI]  (value not drawn)
D15  B540CQ-13-F  [SMC_L6.9-W5.9-LS7.9-RD]  (value not drawn)
F4  PTC RESET FUSE 24V 100mA 0603  [F0603]  (value not drawn)
F5  PTC RESET FUSE 24V 100mA 0603  [F0603]  (value not drawn)
HD1  Header 4  [HED4]
IC5  Low-Power, Slew-Rate-Limited RS-485/RS-422 Transceivers  [SOP-8_L4.9-W3.9-P1.27-LS6.0-BL]  (value not drawn)
IC6  SINGLE 2-INPUT NAND GATE WITH SCHMITT-TRIGGER INPUTS  [SOT-23-5_L3.0-W1.7-P0.95-LS2.8-BL]  (value not drawn)
IC7  CH340  [SOP-16_L10.0-W3.9-P1.27-LS6.0-BL]
Q5  TRANS PNP 25V 1.5A SOT-23  [SOT-23-3_L2.9-W1.3-P1.90-LS2.4-BR]  (value not drawn)
Q6  TRANS NPN 25V 0.5A SOT-23  [SOT-23-3_L2.9-W1.3-P1.90-LS2.4-BR]  (value not drawn)
Q7  TRANS NPN 25V 0.5A SOT-23  [SOT-23-3_L2.9-W1.3-P1.90-LS2.4-BR]  (value not drawn)
Q8  MOSFET P-CH 30V 4.3A SOT-23  [SOT-23-3_L2.9-W1.6-P1.90-LS2.8-BR]  (value not drawn)
Q9  MOSFET P-CH 30V 4.3A SOT-23  [SOT-23-3_L2.9-W1.6-P1.90-LS2.8-BR]  (value not drawn)
Q10  MOSFET P-CH 30V 4.3A SOT-23  [SOT-23-3_L2.9-W1.6-P1.90-LS2.8-BR]  (value not drawn)
Q11  TRANS PNP 40V 200mA SOT-363  [SC-70-6_L2.2-W1.3-P0.65-LS2.1-TL]  (value not drawn)
Q12  TRANS PNP 40V 200mA SOT-363  [SC-70-6_L2.2-W1.3-P0.65-LS2.1-TL]  (value not drawn)
Q13  TRANS PNP 40V 200mA SOT-363  [SC-70-6_L2.2-W1.3-P0.65-LS2.1-TL]  (value not drawn)
Q14  MOSFET P-CH 30V 4.3A SOT-23  [SOT-23-3_L2.9-W1.6-P1.90-LS2.8-BR]  (value not drawn)
R46  10kΩ  [R0603]
R47  0Ω  [R0603]
R48  5.1KΩ  [R0603]
R49  5.1KΩ  [R0603]
R50  0Ω  [R0603]
R51  5.1KΩ  [R0603]
R52  5.1KΩ  [R0603]
R53  0Ω  [R0603]
R54  10kΩ  [R0603]
R55  5.1KΩ  [R0603]
R56  2k2Ω  [R0603]
R57  2k2Ω  [R0603]
R58  10kΩ  [R0603]
R59  5.1KΩ  [R0603]
R60  10kΩ  [R0603]
R61  5.1KΩ  [R0603]
R62  10kΩ  [R0603]
R63  51kΩ  [R0603]
R64  10kΩ  [R0603]
R65  51kΩ  [R0603]
R66  10kΩ  [R0603]
R67  51kΩ  [R0603]
R68  10kΩ  [R0603]
USB1  TYPE C 2.0  [USB-C-SMD_G-SWITCH_GT-USB-7010ASV]
USB2  TYPE C 2.0  [USB-C-SMD_G-SWITCH_GT-USB-7010ASV]
USB3  TYPE C 2.0  [USB-C-SMD_G-SWITCH_GT-USB-7010ASV]
ZJP1  JP4  [CON4]

### Ports
5V (out, see Main[2B], interfaceUART&I2C[2B], Power[3C], RELAY[1A], SOM[3A]), BOOTMODE (bidir, see Main[2B], SOM[6B]), CHIP_PU (bidir, see Main[2B], SOM[4A]), ESP_USB_N (bidir, see Main[2B], SOM[5C]), ESP_USB_P (bidir, see Main[2B], SOM[5C]), RX1 (out, see Main[2B], SOM[6B]), TX1 (in, see Main[2B], SOM[6B]), U0_RX1 (bidir, see Main[1B], interfaceUART&I2C[2B]), UART0_TXD (in, see Main[2B], interfaceUART&I2C[1B], SOM[6B]), USB1P1_N (bidir, see Main[2B], SOM[6C]), USB1P1_P (bidir, see Main[2B], SOM[6C]), VCC3V3 (in, see Main[1B], AUDIO CODEC[2C], Power[4C], SENSOR[3A], SOM[4A]), VCC5V (in, see Main[1B], Power[3A])

### Nets
5V: C43.1 C44.2 D15.1(C) IC5.8(VCC) IC6.5(VCC) Q14.3(D) R54.1 ZJP1.1 ; port 5V
GND: C43.2 C44.1 C45.1 C46.2 C47.1 C48.1 C49.1 C50.1 C51.1 D8.2(A) D12.1(K) HD1.4 IC5.5(GND) IC7.1(GND) Q5.3(C) R46.2 R48.1 R51.1 R59.1 R61.1 R62.1 R63.1 R64.1 R65.1 R66.1 R67.1 R68.1 USB1.1(SHELL) USB1.2(SHELL) USB1.3(SHELL) USB1.4(SHELL) USB1.A1B12(GND) USB1.B1A12(GND) USB2.1(SHELL) USB2.2(SHELL) USB2.3(SHELL) USB2.4(SHELL) USB2.A1B12(GND) USB2.B1A12(GND) USB3.1(SHELL) USB3.2(SHELL) USB3.3(SHELL) USB3.4(SHELL) USB3.A1B12(GND) USB3.B1A12(GND) ZJP1.4
USB1_5V: C50.2 Q8.3(D) Q11.1(E2) USB2.A4B9(VBUS) USB2.B4A9(VBUS)
USB2_5V: C51.2 Q9.3(D) Q12.1(E2) USB1.A4B9(VBUS) USB1.B4A9(VBUS)
USB3_5V: C49.2 Q10.3(D) Q13.1(E2) USB3.A4B9(VBUS) USB3.B4A9(VBUS)
USB_5V: D15.2(A) Q8.2(S) Q9.2(S) Q10.2(S) Q11.4(E1) Q12.4(E1) Q13.4(E1) Q14.1(G) R68.2
VCC3V3: C46.1 C47.2 C48.2 IC7.4(V3) IC7.16(VCC) ; port VCC3V3
VCC5V: Q14.2(S) ; port VCC5V
VCC_IN: HD1.1
Ao: F5.2 HD1.2
Bo: F4.2 HD1.3
BOOTMODE: Q6.3(C) ; port BOOTMODE
CHIP_PU: Q7.3(C) ; port CHIP_PU
DTR: IC7.13(~{DTR}) Q6.2(E) R60.1
DTS: IC7.14(~{RTS}) Q7.2(E) R58.1
EN: IC5.2(~{RE}) IC5.3(DE) IC6.4(Y)
ESP_USB_N: D11.1(K) USB1.A7(DN1) USB1.B7(DN2) ; port ESP_USB_N
ESP_USB_P: D10.1(K) USB1.A6(DP1) USB1.B6(DP2) ; port ESP_USB_P
RX1: R47.1 ZJP1.3 ; port RX1  [project net GPIO27]
TX1: R50.1 R53.1 ZJP1.2 ; port TX1  [project net GPIO26]
TX1_1: IC6.1(A) R53.2 R56.2 R57.1
U0_RX1: IC7.2(TXD) ; port U0_RX1
UART0_TXD: IC7.3(RXD) ; port UART0_TXD  [project net GPIO37]
USB1P1_N: D14.1(K) USB2.A7(DN1) USB2.B7(DN2) ; port USB1P1_N
USB1P1_P: D13.1(K) USB2.A6(DP1) USB2.B6(DP2) ; port USB1P1_P
USB_N: IC7.6(D-) USB3.A7(DN1) USB3.B7(DN2)
USB_P: IC7.5(D+) USB3.A6(DP1) USB3.B6(DP2)
NetC45_2: C45.2 IC6.3(GND)
NetD8_1: D8.1(K) D9.2(A) F4.1 IC5.7(B) R46.1 R49.2
NetD9_1: D9.1(K) D12.2(A) F5.1 IC5.6(A) R49.1 R54.2
NetD10_2: D10.2(A) D11.2(A) R52.1
NetD13_2: D13.2(A) D14.2(A) R55.1
NetIC5_1: IC5.1(RO) R47.2
NetIC5_4: IC5.4(DI) R50.2
NetIC6_2: IC6.2(B) Q5.2(E) R56.1
NetQ5_1: Q5.1(B) R57.2
NetQ6_1: Q6.1(B) R58.2
NetQ7_1: Q7.1(B) R60.2
NetQ8_1: Q8.1(G) Q11.3(C1) R63.2
NetQ9_1: Q9.1(G) Q12.3(C1) R65.2
NetQ10_1: Q10.1(G) Q13.3(C1) R67.2
NetQ11_2: Q11.2(B2) Q11.5(B1) Q11.6(C2) R62.2
NetQ12_2: Q12.2(B2) Q12.5(B1) Q12.6(C2) R64.2
NetQ13_2: Q13.2(B2) Q13.5(B1) Q13.6(C2) R66.2
NetR48_2: R48.2 USB1.A5(CC1)
NetR51_2: R51.2 USB2.A5(CC1)
NetR52_2: R52.2 USB1.B5(CC2)
NetR55_2: R55.2 USB2.B5(CC2)
NetR59_2: R59.2 USB3.A5(CC1)
NetR61_2: R61.2 USB3.B5(CC2)

Not connected (* = marked no-connect by the designer): IC7 7(NC.)* 8(~{OUT})* 9(~{CTS}) 10(~{DSR}) 11(~{RI}) 12(~{DCD}) 15(R232)*; USB1 A8(SBU1)* B8(SBU2)*; USB2 A8(SBU1)* B8(SBU2)*; USB3 A8(SBU1)* B8(SBU2)*

### Layout directives
net class USB: USB_N, USB_P
differential pair; net class DIFF90; differential pair class DIFF90: USB_N, USB_P

### Notes on the sheet
- MODBUS RTU MAX485
- FULL SPEED USB
- HIGH SPEED USB
- USB TTL

### Library data of the parts
C43-C46 C48 = CC0603KRX7R9BB104: as C1 on sheet Power
C47 = CL10A106MA8NRNC: as C3 on sheet Power
C49-C51 = CL10B105KA8NNNC: as C8 on sheet Power
D8-D14 = LESD5D5.0CT1G: 9.4A@8/20us 18.6V 7.8V 5V SOD-523 TVS Diodes RoHS
D15 = B540CQ-13-F: as D2 on sheet Power
F4 F5 = 0603-010-24V: 24V 100mA 40A 300mA 900mΩ 0603 PTC Resettable Fuses RoHS
HD1 = Hed4: Header 4 (Green); Value: Header 4
IC5 = MAX485ESA+T_C41365333: Transceiver 4.75V~5.25V SOIC-8 Drivers, Receivers, Transceivers RoHS
IC6 = TP74LVC1G132S5: 5ns@5V,50pF 10uA 1.65V~5.5V NAND Gate SOT-23-5 Gates and Inverters RoHS
IC7 = CH340C: Transceiver USB 2.0 SOP-16 Interface Controllers RoHS
Q5 = SS8550_C7420371: 300mW 25V 1.5A PNP SOT-23 Single Bipolar Transistors RoHS
Q6 Q7 = S8050_C2828466: 300mW 25V 500mA NPN SOT-23 Single Bipolar Transistors RoHS
Q8-Q10 Q14 = AO3407A: as Q1 on sheet Power
Q11-Q13 = LMBT3906DW1T1: 40V 150mW 200mA PNP SOT-363 Single Bipolar Transistors RoHS
R46 R54 R58 R60 R62 R64 R66 R68 = RC0603FR-0710KL: as R8 on sheet Power
R47 R50 R53 = RC0603JR-070RL: as R9 on sheet Power
R48 R49 R51 R52 R55 R59 R61 = FRC0603F5101TS: as R37 on sheet MICROSD CARD
R56 R57 = RC0603FR-072K2L: 100mW 2.2kΩ 75V ±100ppm/℃ Thick Film Resistor ±1% 0603 Chip Resistor - Surface Mount RoHS
R63 R65 R67 = RC0603FR-07100KL_1RC0603FR-0751KL: 100mW 51kΩ 75V ±100ppm/℃ Thick Film Resistor ±1% 0603 Chip Resistor - Surface Mount RoHS
USB1-USB3 = GT-USB-7010ASV: USB 2.0 1 16P -40℃~+85℃ Type-C SMD USB, DVI, HDMI Connector Assemblies RoHS
ZJP1 = Con4: Connector 4; Value: Connector 4

## Sheet DSI&CSI CONNECTOR.SchDoc
size A4; SheetNumber: 10; SheetTotal: 11
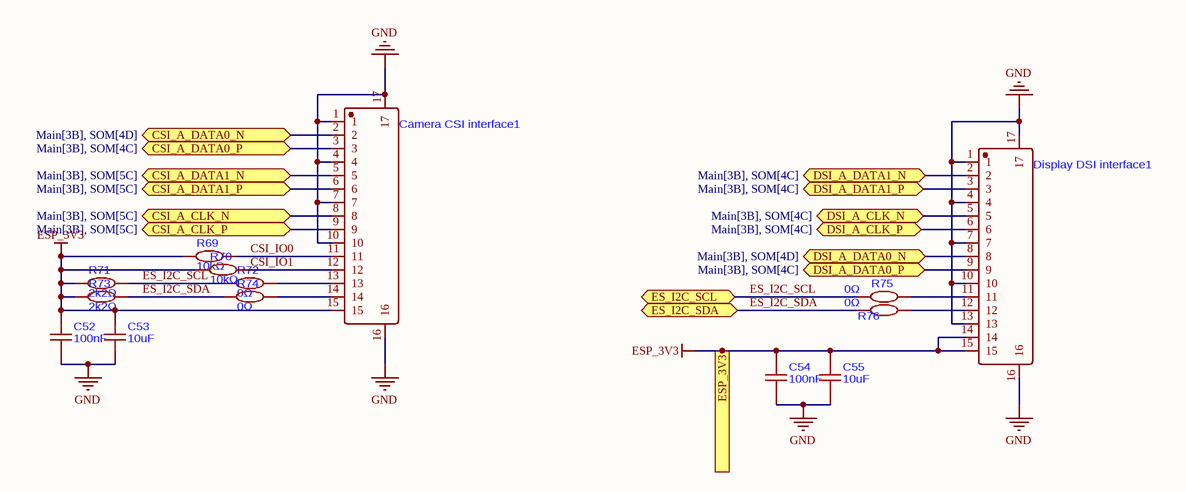
[diagram p6: DSI&CSI CONNECTOR.SchDoc]

### Parts
C52  100nF  [C0603]
C53  10uF  [C0603]
C54  100nF  [C0603]
C55  10uF  [C0603]
Camera_CSI_interface1  CONN FFC FPC 15POS 1mm BOTTOM CNT SMD R/A  [FPC-SMD_15P-P1.00_XUNPU_FPC-1.0FX-15PWCR-H20]  (value not drawn)
Display_DSI_interface1  CONN FFC FPC 15POS 1mm BOTTOM CNT SMD R/A  [FPC-SMD_15P-P1.00_XUNPU_FPC-1.0FX-15PWCR-H20]  (value not drawn)
R69  10kΩ  [R0603]
R70  10kΩ  [R0603]
R71  2k2Ω  [R0603]
R72  0Ω  [R0603]
R73  2k2Ω  [R0603]
R74  0Ω  [R0603]
R75  0Ω  [R0603]
R76  0Ω  [R0603]

### Ports
CSI_A_CLK_N (bidir, see Main[3B], SOM[5C]), CSI_A_CLK_P (bidir, see Main[3B], SOM[5C]), CSI_A_DATA0_N (bidir, see Main[3B], SOM[4D]), CSI_A_DATA0_P (bidir, see Main[3B], SOM[4C]), CSI_A_DATA1_N (bidir, see Main[3B], SOM[5C]), CSI_A_DATA1_P (bidir, see Main[3B], SOM[5C]), DSI_A_CLK_N (bidir, see Main[3B], SOM[4C]), DSI_A_CLK_P (bidir, see Main[3B], SOM[4C]), DSI_A_DATA0_N (bidir, see Main[3B], SOM[4D]), DSI_A_DATA0_P (bidir, see Main[3B], SOM[4C]), DSI_A_DATA1_N (bidir, see Main[3B], SOM[4C]), DSI_A_DATA1_P (bidir, see Main[3B], SOM[4C]), ES_I2C_SCL (bidir, see Main[4B], AUDIO CODEC[1B], interfaceUART&I2C[2C], SOM[6C]), ES_I2C_SDA (bidir, see Main[4B], AUDIO CODEC[1A], interfaceUART&I2C[2C], SOM[6C]), ESP_3V3 (in, see Main[4B], ETH-PHY[2A], interfaceUART&I2C[1C], Power[4C], SOM[6B])

### Nets
ESP_3V3: C52.2 C53.2 C54.2 C55.2 Camera_CSI_interface1.15 Display_DSI_interface1.14 Display_DSI_interface1.15 R69.1 R70.1 R71.1 R73.1 ; port ESP_3V3
GND: C52.1 C53.1 C54.1 C55.1 Camera_CSI_interface1.1 Camera_CSI_interface1.4 Camera_CSI_interface1.7 Camera_CSI_interface1.10 Camera_CSI_interface1.16 Camera_CSI_interface1.17 Display_DSI_interface1.1 Display_DSI_interface1.4 Display_DSI_interface1.7 Display_DSI_interface1.10 Display_DSI_interface1.13 Display_DSI_interface1.16 Display_DSI_interface1.17
CSI_A_CLK_N: Camera_CSI_interface1.8 ; port CSI_A_CLK_N
CSI_A_CLK_P: Camera_CSI_interface1.9 ; port CSI_A_CLK_P
CSI_A_DATA0_N: Camera_CSI_interface1.2 ; port CSI_A_DATA0_N
CSI_A_DATA0_P: Camera_CSI_interface1.3 ; port CSI_A_DATA0_P
CSI_A_DATA1_N: Camera_CSI_interface1.5 ; port CSI_A_DATA1_N
CSI_A_DATA1_P: Camera_CSI_interface1.6 ; port CSI_A_DATA1_P
CSI_IO0: Camera_CSI_interface1.11 R69.2
CSI_IO1: Camera_CSI_interface1.12 R70.2
DSI_A_CLK_N: Display_DSI_interface1.5 ; port DSI_A_CLK_N
DSI_A_CLK_P: Display_DSI_interface1.6 ; port DSI_A_CLK_P
DSI_A_DATA0_N: Display_DSI_interface1.8 ; port DSI_A_DATA0_N
DSI_A_DATA0_P: Display_DSI_interface1.9 ; port DSI_A_DATA0_P
DSI_A_DATA1_N: Display_DSI_interface1.2 ; port DSI_A_DATA1_N
DSI_A_DATA1_P: Display_DSI_interface1.3 ; port DSI_A_DATA1_P
ES_I2C_SCL: R71.2 R72.1 R75.1 ; port ES_I2C_SCL
ES_I2C_SDA: R73.2 R74.1 R76.1 ; port ES_I2C_SDA
NetCamera_CSI_interface1_13: Camera_CSI_interface1.13 R72.2
NetCamera_CSI_interface1_14: Camera_CSI_interface1.14 R74.2
NetDisplay_DSI_interface1_11: Display_DSI_interface1.11 R75.2
NetDisplay_DSI_interface1_12: Display_DSI_interface1.12 R76.2

### Library data of the parts
C52 C54 = CC0603KRX7R9BB104: as C1 on sheet Power
C53 C55 = CL10A106MA8NRNC: as C3 on sheet Power
Camera_CSI_interface1 Display_DSI_interface1 = FPC-1.0FX-15PWCR-H20: -25℃~+85℃ Hinged Lid 15P 1mm 500mA 50V Bottom Contact Surface Mount, Right Angle SMD,P=1mm,Surface Mount,Right Angle FFC, FPC (Flat Flexible) Connector Assemblies RoHS
R69 R70 = RC0603FR-0710KL: as R8 on sheet Power
R71 R73 = RC0603FR-072K2L: as R56 on sheet USB
R72 R74-R76 = RC0603JR-070RL: as R9 on sheet Power

## Sheet ETH-PHY.SchDoc
size A4; SheetNumber: 7; SheetTotal: 11
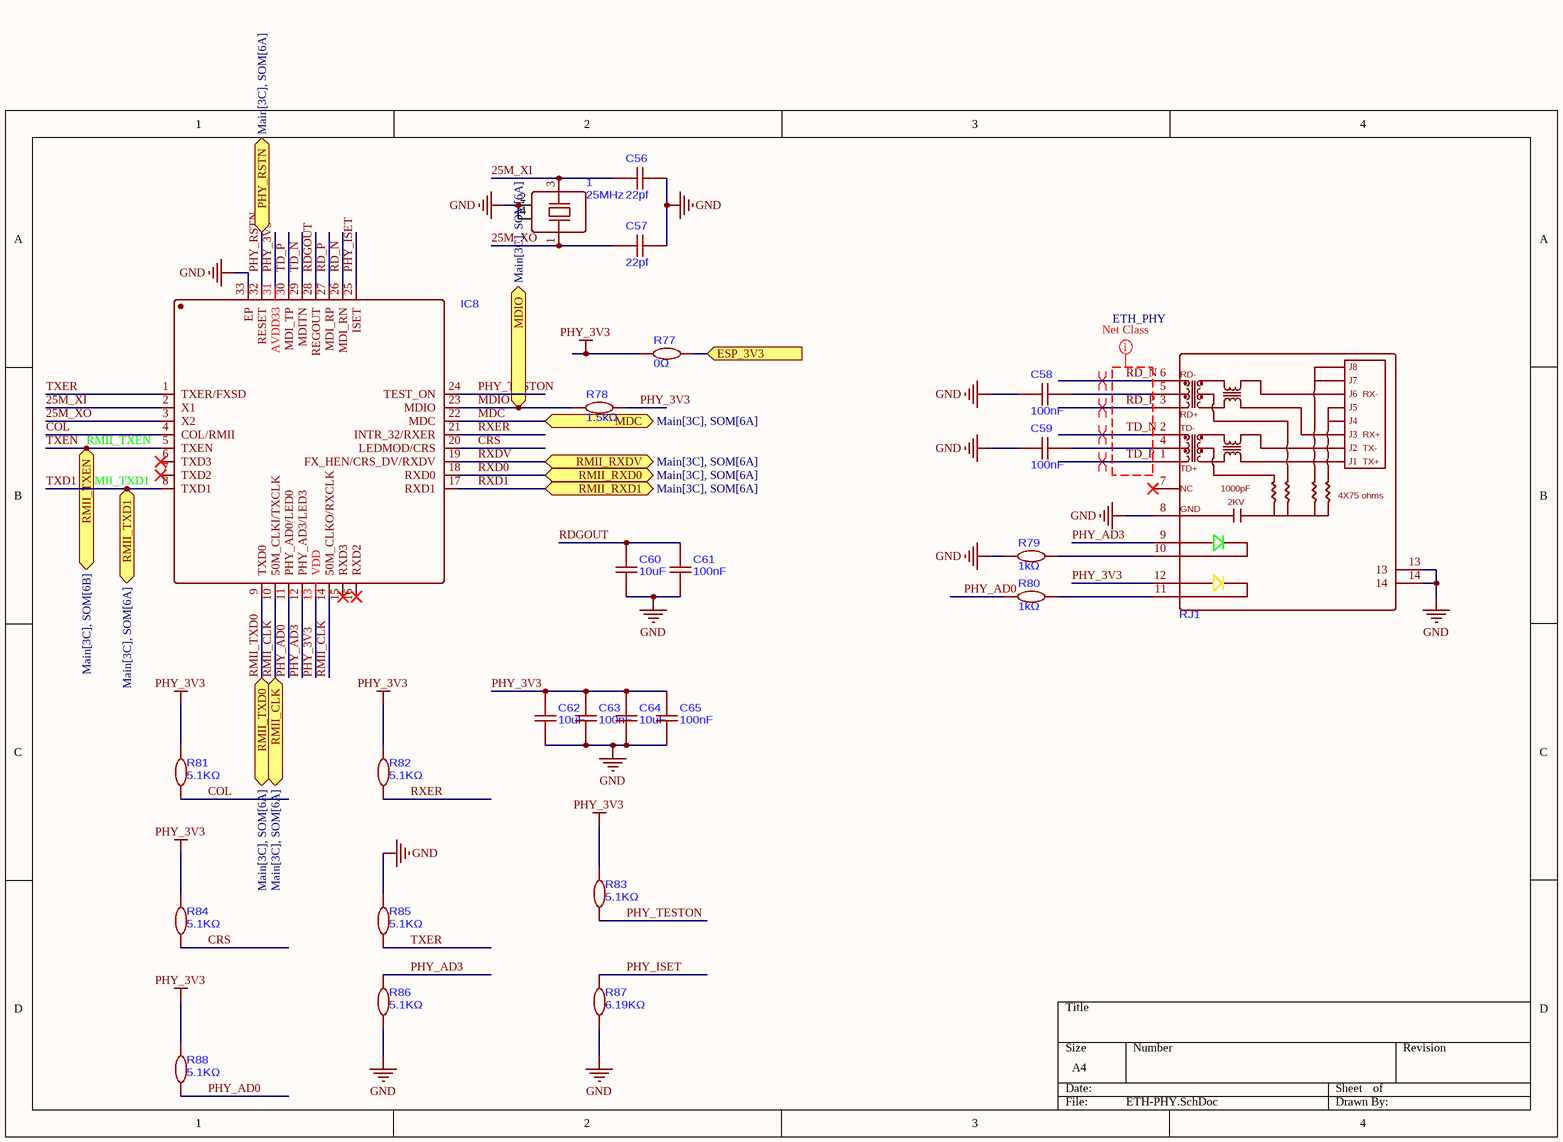
[diagram p7: ETH-PHY.SchDoc]

### Parts
1  25MHz  [CRYSTAL-SMD_4P-L3.2-W2.5-BL]
C56  22pf  [C0603]
C57  22pf  [C0603]
C58  100nF  [C0603]
C59  100nF  [C0603]
C60  10uF  [C0603]
C61  100nF  [C0603]
C62  10uF  [C0603]
C63  100nF  [C0603]
C64  10uF  [C0603]
C65  100nF  [C0603]
IC8  Single Port Fast Ethernet Transceiver  [QFN-32_L4.0-W4.0-P0.40-BL-EP2.7]  (value not drawn)
R77  0Ω  [R0603]
R78  1.5kΩ  [R0603]
R79  1kΩ  [R0603]
R80  1kΩ  [R0603]
R81  5.1KΩ  [R0603]
R82  5.1KΩ  [R0603]
R83  5.1KΩ  [R0603]
R84  5.1KΩ  [R0603]
R85  5.1KΩ  [R0603]
R86  5.1KΩ  [R0603]
R87  6.19KΩ  [R0603]
R88  5.1KΩ  [R0603]
RJ1  CONN MOD JACK RJ45 TH  [RJ45-TH_HR913550A]  (value not drawn)

### Ports
ESP_3V3 (in, see Main[4C], DSI&CSI CONNECTOR[3C], interfaceUART&I2C[1C], Power[4C], SOM[6B]), MDC (bidir, see Main[3C], SOM[6A]), MDIO (bidir, see Main[3C], SOM[6A]), PHY_RSTN (bidir, see Main[3C], SOM[6A]), RMII_CLK (bidir, see Main[3C], SOM[6A]), RMII_RXD0 (bidir, see Main[3C], SOM[6A]), RMII_RXD1 (bidir, see Main[3C], SOM[6A]), RMII_RXDV (bidir, see Main[3C], SOM[6A]), RMII_TXD0 (bidir, see Main[3C], SOM[6A]), RMII_TXD1 (bidir, see Main[3C], SOM[6A]), RMII_TXEN (bidir, see Main[3C], SOM[6B])

### Nets
ESP_3V3: R77.2 ; port ESP_3V3
GND: 1.2(GND) 1.4(GND) C56.2 C57.2 C58.1 C59.1 C60.1 C61.1 C62.1 C63.1 C64.1 C65.1 IC8.33(EP) R79.1 R85.2 R86.2 R87.1 RJ1.8(GND) RJ1.13 RJ1.14
PHY_3V3: C62.2 C63.2 C64.2 C65.2 IC8.13(VDD) IC8.31(AVDD33) R77.1 R78.2 R81.2 R82.2 R83.2 R84.2 R88.2 RJ1.12
25M_XI: 1.3(OSC2) C56.1 IC8.2(X1)
25M_XO: 1.1(OSC1) C57.1 IC8.3(X2)
COL: IC8.4(COL/RMII) R81.1
CRS: IC8.20(LEDMOD/CRS) R84.1
MDC: IC8.22(MDC) ; port MDC  [project net GPIO31]
MDIO: IC8.23(MDIO) R78.1 ; port MDIO  [project net GPIO52]
PHY_AD0: IC8.11(PHY_AD0/LED0) R80.1 R88.1
PHY_AD3: IC8.12(PHY_AD3/LED3) R86.1 RJ1.9
PHY_ISET: IC8.25(ISET) R87.2
PHY_RSTN: IC8.32(RESET) ; port PHY_RSTN  [project net GPIO51]
PHY_TESTON: IC8.24(TEST_ON) R83.1
RD_N: IC8.26(MDI_RN) RJ1.6
RD_P: IC8.27(MDI_RP) RJ1.3
RDGOUT: C60.2 C61.2 IC8.28(REGOUT)
RMII_CLK: IC8.10(50M_CLKI/TXCLK) IC8.14(50M_CLKO/RXCLK) ; port RMII_CLK  [project net GPIO50]
RMII_TXD0: IC8.9(TXD0) ; port RMII_TXD0  [project net GPIO34]
RMII_TXD1: IC8.8(TXD1) ; port RMII_TXD1  [also labelled TXD1]  [project net BOOTMODE]
RMII_TXEN: IC8.5(TXEN) ; port RMII_TXEN  [also labelled TXEN]  [project net GPIO49]
RXD0: IC8.18(RXD0) ; port RMII_RXD0  [project net GPIO29]
RXD1: IC8.17(RXD1) ; port RMII_RXD1  [project net GPIO30]
RXDV: IC8.19(FX_HEN/CRS_DV/RXDV) ; port RMII_RXDV  [project net GPIO28]
RXER: IC8.21(INTR_32/RXER) R82.1
TD_N: IC8.29(MDITN) RJ1.2
TD_P: IC8.30(MDI_TP) RJ1.1
TXER: IC8.1(TXER/FXSD) R85.1
NetC58_2: C58.2 RJ1.5
NetC59_2: C59.2 RJ1.4
NetR79_2: R79.2 RJ1.10
NetR80_2: R80.2 RJ1.11

Not connected (* = marked no-connect by the designer): IC8 6(TXD3)* 7(TXD2)* 15(RXD3)* 16(RXD2)*; RJ1 7(NC)*

### Layout directives
net class ETH_PHY: RD_N, RD_P, TD_N, TD_P
differential pair; net class DIFF100; differential pair class DIFF100: RD_N, RD_P, TD_N, TD_P

### Notes on the sheet
- (in symbol HR913550A) J8; RD-; J7; J6; RX-; J5; RD+; J4; TD-; J3; RX+; J2; TX-; J1; TX+; TD+; 1000pF; 4X75 ohms; 2KV

### Library data of the parts
1 = X322525MOB4SI
C56 C57 = CL10C220JB8NNNC: as C20 on sheet Power
C58 C59 C61 C63 C65 = CC0603KRX7R9BB104: as C1 on sheet Power
C60 C62 C64 = CL10A106MA8NRNC: as C3 on sheet Power
IC8 = IP101GRI: Ethernet Transceiver 3.3V QFN-32-EP(4x4) Drivers, Receivers, Transceivers RoHS
R77 = RC0603JR-070RL: as R9 on sheet Power
R78 = RC0603FR-071K5L: 100mW 1.5kΩ 75V ±100ppm/℃ Thick Film Resistor ±1% 0603 Chip Resistor - Surface Mount RoHS
R79 R80 = RMC 0603 1K J N: as R4 on sheet Power
R81-R86 R88 = FRC0603F5101TS: as R37 on sheet MICROSD CARD
R87 = AC0603FR-076K19L: 6.19kΩ 100mW 75V ±100ppm/℃ Thick Film Resistor ±1% 0603 Chip Resistor - Surface Mount RoHS
RJ1 = HR913550A: 1 With LED Through Hole Modular/Ethernet Connector Jacks With Magnetics RoHS

## Sheet SOM.SchDoc
size A3; SheetNumber: 8; SheetTotal: 11
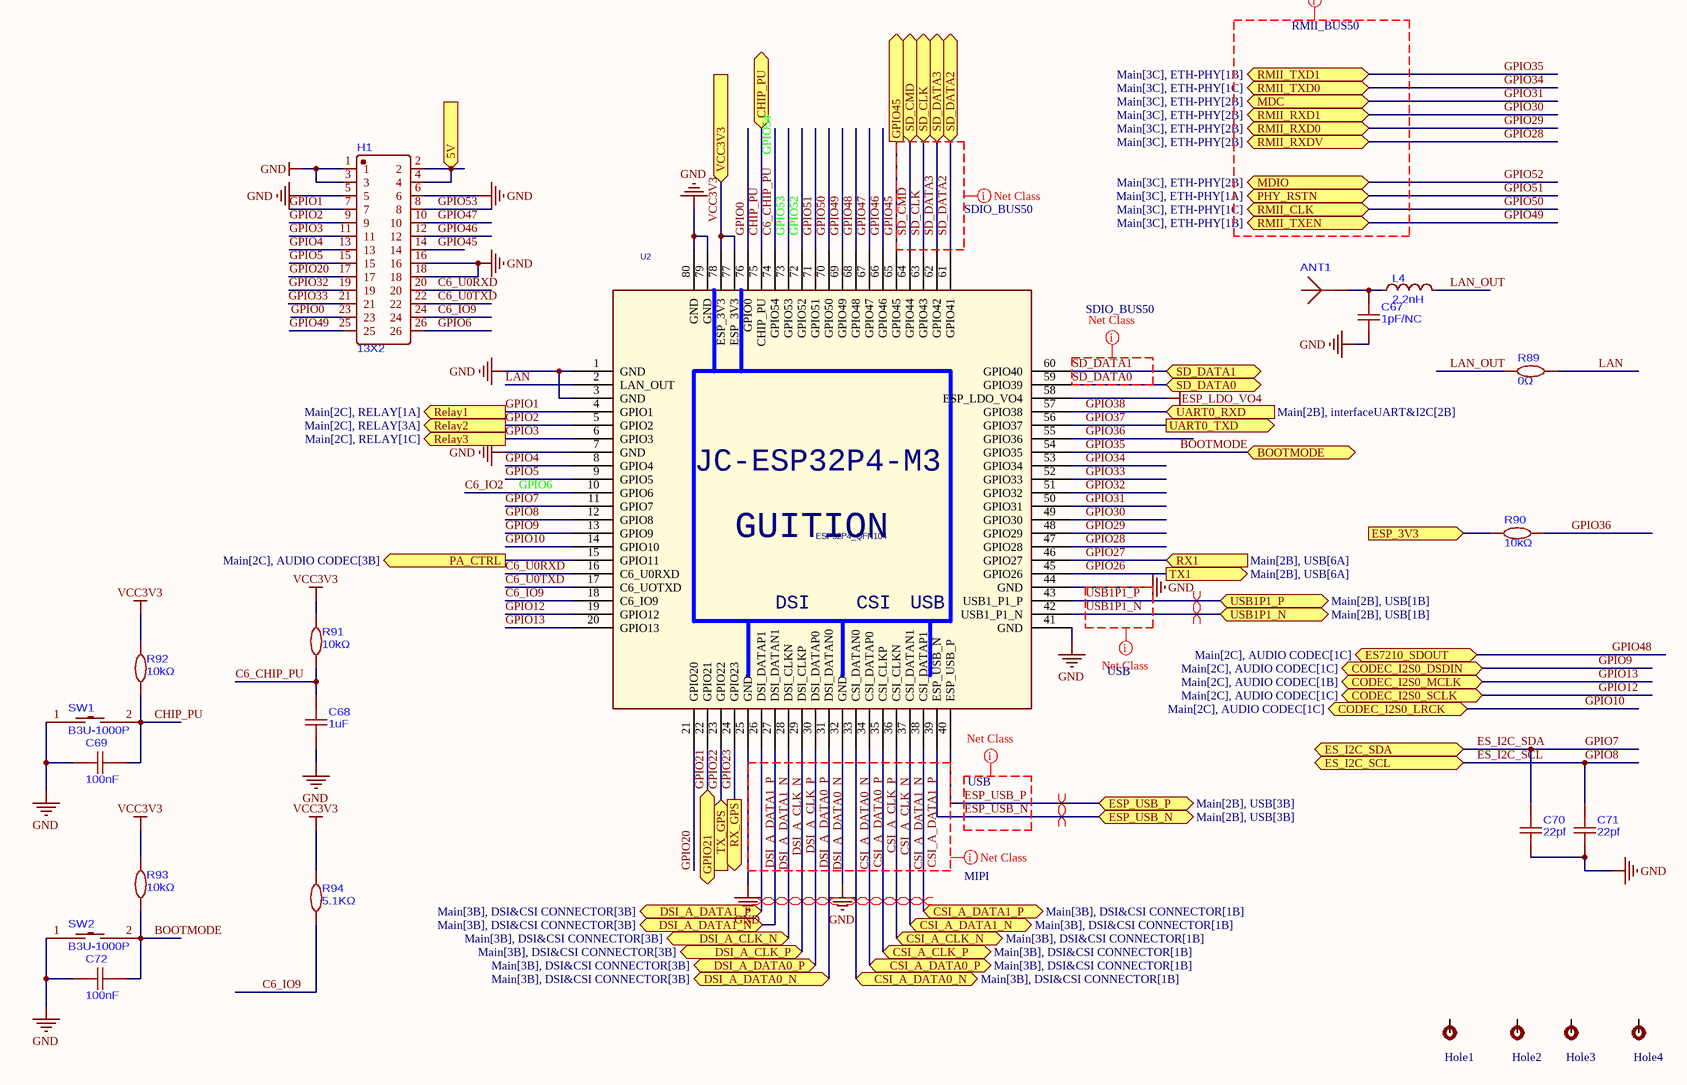
[diagram p8: SOM.SchDoc]

### Parts
ANT1  RF ANT 2450MHz CERAMIC SMD  [ANT-SMD-2_L3.2-W1.6-C504002]  (value not drawn)
C67  1pF/NC  [C0603]
C68  1uF  [C0603]
C69  100nF  [C0603]
C70  22pf  [C0603]
C71  22pf  [C0603]
C72  100nF  [C0603]
H1  13X2  [HDR-TH_26P-P2.54-V-M-R2-C13-S2.54]
Hole1  Pad Big  [Screw 3.0]  (value not drawn)
Hole2  Pad Big  [Screw 3.0]  (value not drawn)
Hole3  Pad Big  [Screw 3.0]  (value not drawn)
Hole4  Pad Big  [Screw 3.0]  (value not drawn)
L4  2.2nH  [C0603]
R89  0Ω  [R0603]
R90  10kΩ  [R0603]
R91  10kΩ  [R0603]
R92  10kΩ  [R0603]
R93  10kΩ  [R0603]
R94  5.1KΩ  [R0603]
SW1  B3U-1000P  [KEY-SMD_B3U-1000PM]
SW2  B3U-1000P  [KEY-SMD_B3U-1000PM]
U2  ESP32P4_QFN104  [JC-ESP32P4-M3_V0.2]

### Ports
5V (in, see Main[2A], interfaceUART&I2C[2B], Power[3C], RELAY[1A], USB[2D]), BOOTMODE (bidir, see Main[2B], USB[5C]), CHIP_PU (bidir, see Main[2B], USB[4C]), CODEC_I2S0_DSDIN (bidir, see Main[2C], AUDIO CODEC[1C]), CODEC_I2S0_LRCK (bidir, see Main[2C], AUDIO CODEC[1C]), CODEC_I2S0_MCLK (bidir, see Main[2C], AUDIO CODEC[1B]), CODEC_I2S0_SCLK (bidir, see Main[2C], AUDIO CODEC[1C]), CSI_A_CLK_N (bidir, see Main[3B], DSI&CSI CONNECTOR[1B]), CSI_A_CLK_P (bidir, see Main[3B], DSI&CSI CONNECTOR[1B]), CSI_A_DATA0_N (bidir, see Main[3B], DSI&CSI CONNECTOR[1B]), CSI_A_DATA0_P (bidir, see Main[3B], DSI&CSI CONNECTOR[1B]), CSI_A_DATA1_N (bidir, see Main[3B], DSI&CSI CONNECTOR[1B]), CSI_A_DATA1_P (bidir, see Main[3B], DSI&CSI CONNECTOR[1B]), DSI_A_CLK_N (bidir, see Main[3B], DSI&CSI CONNECTOR[3B]), DSI_A_CLK_P (bidir, see Main[3B], DSI&CSI CONNECTOR[3B]), DSI_A_DATA0_N (bidir, see Main[3B], DSI&CSI CONNECTOR[3B]), DSI_A_DATA0_P (bidir, see Main[3B], DSI&CSI CONNECTOR[3B]), DSI_A_DATA1_N (bidir, see Main[3B], DSI&CSI CONNECTOR[3B]), DSI_A_DATA1_P (bidir, see Main[3B], DSI&CSI CONNECTOR[3B]), ES7210_SDOUT (bidir, see Main[2C], AUDIO CODEC[1C]), ES_I2C_SCL (bidir, see Main[2B], AUDIO CODEC[1B], DSI&CSI CONNECTOR[2C], interfaceUART&I2C[2C]), ES_I2C_SDA (bidir, see Main[2B], AUDIO CODEC[1A], DSI&CSI CONNECTOR[2C], interfaceUART&I2C[2C]), ESP_3V3 (in, see Main[2A], DSI&CSI CONNECTOR[3C], ETH-PHY[2A], interfaceUART&I2C[1C], Power[4C]), ESP_USB_N (bidir, see Main[2B], USB[3B]), ESP_USB_P (bidir, see Main[2B], USB[3B]), GPIO21 (bidir, see Main[3C], SENSOR[4B]), GPIO45 (out, see Main[3A], MICROSD CARD[1B]), MDC (bidir, see Main[3C], ETH-PHY[2B]), MDIO (bidir, see Main[3C], ETH-PHY[2B]), PA_CTRL (out, see Main[2C], AUDIO CODEC[3B]), PHY_RSTN (bidir, see Main[3C], ETH-PHY[1A]), Relay1 (out, see Main[2C], RELAY[1A]), Relay2 (out, see Main[2C], RELAY[3A]), Relay3 (out, see Main[2C], RELAY[1C]), RMII_CLK (bidir, see Main[3C], ETH-PHY[1C]), RMII_RXD0 (bidir, see Main[3C], ETH-PHY[2B]), RMII_RXD1 (bidir, see Main[3C], ETH-PHY[2B]), RMII_RXDV (bidir, see Main[3C], ETH-PHY[2B]), RMII_TXD0 (bidir, see Main[3C], ETH-PHY[1C]), RMII_TXD1 (bidir, see Main[3C], ETH-PHY[1B]), RMII_TXEN (bidir, see Main[3C], ETH-PHY[1B]), RX1 (in, see Main[2B], USB[6A]), RX_GPS (out, see Main[3C], SENSOR[2B]), SD_CLK (bidir, see Main[3A], MICROSD CARD[2B]), SD_CMD (bidir, see Main[3A], MICROSD CARD[2B]), SD_DATA0 (bidir, see Main[3A], MICROSD CARD[2C]), SD_DATA1 (bidir, see Main[3A], MICROSD CARD[2C]), SD_DATA2 (bidir, see Main[3A], MICROSD CARD[2B]), SD_DATA3 (bidir, see Main[3A], MICROSD CARD[2B]), TX1 (out, see Main[2B], USB[6A]), TX_GPS (in, see Main[3C], SENSOR[2B]), UART0_RXD (in, see Main[2B], interfaceUART&I2C[2B]), UART0_TXD (out, see Main[2B], interfaceUART&I2C[1B], USB[2C]), USB1P1_N (bidir, see Main[2B], USB[1B]), USB1P1_P (bidir, see Main[2B], USB[1B]), VCC3V3 (in, see Main[2A], AUDIO CODEC[2C], Power[4C], SENSOR[3A], USB[4C])

### Nets
5V: H1.2 H1.4 ; port 5V
ESP_3V3: R90.1 ; port ESP_3V3
ESP_LDO_VO4: U2.58(ESP_LDO_VO4)
GND: C67.1 C68.1 C69.2 C70.1 C71.1 C72.2 H1.1 H1.3 H1.5 H1.6 H1.16 H1.18 SW1.1 SW2.1 U2.1(GND) U2.3(GND) U2.7(GND) U2.25(GND) U2.32(GND) U2.41(GND) U2.44(GND) U2.79(GND) U2.80(GND)
VCC3V3: R91.2 R92.2 R93.2 R94.2 U2.77(ESP_3V3) U2.78(ESP_3V3) ; port VCC3V3
BOOTMODE: C72.1 R93.1 SW2.2 U2.54(GPIO35) ; port BOOTMODE, port RMII_TXD1  [also labelled GPIO35]
C6_CHIP_PU: C68.2 R91.1 U2.74(GPIO54)  [also labelled GPIO54]
C6_IO2: H1.26 U2.10(GPIO6)  [also labelled GPIO6]
C6_IO9: H1.24 R94.1 U2.18(C6_IO9)
C6_U0RXD: H1.20 U2.16(C6_U0RXD)
C6_U0TXD: H1.22 U2.17(C6_UOTXD)
CHIP_PU: C69.1 R92.1 SW1.2 U2.75(CHIP_PU) ; port CHIP_PU
CSI_A_CLK_N: U2.36(CSI_CLKN) ; port CSI_A_CLK_N
CSI_A_CLK_P: U2.35(CSI_CLKP) ; port CSI_A_CLK_P
CSI_A_DATA0_N: U2.33(CSI_DATAN0) ; port CSI_A_DATA0_N
CSI_A_DATA0_P: U2.34(CSI_DATAP0) ; port CSI_A_DATA0_P
CSI_A_DATA1_N: U2.37(CSI_DATAN1) ; port CSI_A_DATA1_N
CSI_A_DATA1_P: U2.38(CSI_DATAP1) ; port CSI_A_DATA1_P
DSI_A_CLK_N: U2.28(DSI_CLKN) ; port DSI_A_CLK_N
DSI_A_CLK_P: U2.29(DSI_CLKP) ; port DSI_A_CLK_P
DSI_A_DATA0_N: U2.31(DSI_DATAN0) ; port DSI_A_DATA0_N
DSI_A_DATA0_P: U2.30(DSI_DATAP0) ; port DSI_A_DATA0_P
DSI_A_DATA1_N: U2.27(DSI_DATAN1) ; port DSI_A_DATA1_N
DSI_A_DATA1_P: U2.26(DSI_DATAP1) ; port DSI_A_DATA1_P
ES_I2C_SCL: C71.2 U2.12(GPIO8) ; port ES_I2C_SCL  [also labelled GPIO8]
ES_I2C_SDA: C70.2 U2.11(GPIO7) ; port ES_I2C_SDA  [also labelled GPIO7]
ESP_USB_N: U2.39(ESP_USB_N) ; port ESP_USB_N
ESP_USB_P: U2.40(ESP_USB_P) ; port ESP_USB_P
GPIO0: H1.23 U2.76(GPIO0)
GPIO1: H1.7 U2.4(GPIO1) ; port Relay1
GPIO2: H1.9 U2.5(GPIO2) ; port Relay2
GPIO3: H1.11 U2.6(GPIO3) ; port Relay3
GPIO4: H1.13 U2.8(GPIO4)
GPIO5: H1.15 U2.9(GPIO5)
GPIO9: U2.13(GPIO9) ; port CODEC_I2S0_DSDIN  [project net CODEC_I2S0_DSDIN]
GPIO10: U2.14(GPIO10) ; port CODEC_I2S0_LRCK  [project net CODEC_I2S0_LRCK]
GPIO12: U2.19(GPIO12) ; port CODEC_I2S0_SCLK  [project net CODEC_I2S0_SCLK]
GPIO13: U2.20(GPIO13) ; port CODEC_I2S0_MCLK  [project net CODEC_I2S0_MCLK]
GPIO20: H1.17 U2.21(GPIO20)
GPIO21: U2.22(GPIO21) ; port GPIO21
GPIO22: U2.23(GPIO22) ; port TX_GPS
GPIO23: U2.24(GPIO23) ; port RX_GPS
GPIO26: U2.45(GPIO26) ; port TX1
GPIO27: U2.46(GPIO27) ; port RX1
GPIO28: U2.47(GPIO28) ; port RMII_RXDV
GPIO29: U2.48(GPIO29) ; port RMII_RXD0
GPIO30: U2.49(GPIO30) ; port RMII_RXD1
GPIO31: U2.50(GPIO31) ; port MDC
GPIO32: H1.19 U2.51(GPIO32)
GPIO33: H1.21 U2.52(GPIO33)
GPIO34: U2.53(GPIO34) ; port RMII_TXD0
GPIO36: R90.2 U2.55(GPIO36)
GPIO37: U2.56(GPIO37) ; port UART0_TXD
GPIO38: U2.57(GPIO38) ; port UART0_RXD
GPIO45: H1.14 U2.65(GPIO45) ; port GPIO45
GPIO46: H1.12 U2.66(GPIO46)
GPIO47: H1.10 U2.67(GPIO47)
GPIO48: U2.68(GPIO48) ; port ES7210_SDOUT  [project net ES7210_SDOUT]
GPIO49: H1.25 U2.69(GPIO49) ; port RMII_TXEN
GPIO50: U2.70(GPIO50) ; port RMII_CLK
GPIO51: U2.71(GPIO51) ; port PHY_RSTN
GPIO52: U2.72(GPIO52) ; port MDIO
GPIO53: H1.8 U2.73(GPIO53)
LAN: R89.2 U2.2(LAN_OUT)
LAN_OUT: L4.2 R89.1
SD_CLK: U2.63(GPIO43) ; port SD_CLK
SD_CMD: U2.64(GPIO44) ; port SD_CMD
SD_DATA0: U2.59(GPIO39) ; port SD_DATA0
SD_DATA1: U2.60(GPIO40) ; port SD_DATA1
SD_DATA2: U2.61(GPIO41) ; port SD_DATA2
SD_DATA3: U2.62(GPIO42) ; port SD_DATA3
USB1P1_N: U2.42(USB1_P1_N) ; port USB1P1_N
USB1P1_P: U2.43(USB1_P1_P) ; port USB1P1_P
NetANT1_2: ANT1.2 C67.2 L4.1
NetIC4_1: U2.15(GPIO11) ; port PA_CTRL

Not connected (* = marked no-connect by the designer): ANT1 1(ANT); Hole1 1; Hole2 1; Hole3 1; Hole4 1

### Layout directives
net class USB: ESP_USB_N, ESP_USB_P, GND, USB1P1_N, USB1P1_P
differential pair; net class DIFF90; differential pair class DIFF90: ESP_USB_N, ESP_USB_P, USB1P1_N, USB1P1_P
net class MIPI: CSI_A_CLK_N, CSI_A_CLK_P, CSI_A_DATA0_N, CSI_A_DATA0_P, CSI_A_DATA1_N, CSI_A_DATA1_P, DSI_A_CLK_N, DSI_A_CLK_P, DSI_A_DATA0_N, DSI_A_DATA0_P, DSI_A_DATA1_N, DSI_A_DATA1_P
differential pair; net class DIFF100; differential pair class DIFF100: CSI_A_CLK_N, CSI_A_CLK_P, CSI_A_DATA0_N, CSI_A_DATA0_P, CSI_A_DATA1_N, CSI_A_DATA1_P, DSI_A_CLK_N, DSI_A_CLK_P, DSI_A_DATA0_N, DSI_A_DATA0_P, DSI_A_DATA1_N, DSI_A_DATA1_P
net class SDIO_BUS50: GPIO45, SD_CLK, SD_CMD, SD_DATA0, SD_DATA1, SD_DATA2, SD_DATA3
net class RMII_BUS50: (no net found under the mark)

### Notes on the sheet
- (in symbol JC-ESP32P4-M3) GUITION; DSI; CSI; USB

### Library data of the parts
ANT1 = kinghelm KH-3216-A35: Ceramic Antenna 5.19dBi 100MHz 2.45GHz 1206 RF Antennas RoHS
C67 = FCC0603N1R0C500CT: 50V 1pF C0G 0603 Ceramic Capacitors RoHS
C68 = CL10B105KA8NNNC: as C8 on sheet Power
C69 C72 = CC0603KRX7R9BB104: as C1 on sheet Power
C70 C71 = CL10C220JB8NNNC: as C20 on sheet Power
H1 = HX PZ2.54-2X13P ZZ: 26P 2x13P Gold Copper Alloy -40℃~+105℃ Pin Header Black 2.54mm 2.5mm 6mm 1kV 3mm 3A 2 Through Hole 2.54mm Through Hole,P=2.54mm Headers, Male Pins RoHS
Hole1-Hole4 = Pad_Big: Value: Pad Big - Hole
L4 = MQG06HF2N2JT7: 700mA 2.2nH ±5% Wirewound Chip Inductor 80mΩ 0603 Fixed Inductors RoHS
R89 = RC0603JR-070RL: as R9 on sheet Power
R90-R93 = RC0603FR-0710KL: as R8 on sheet Power
R94 = FRC0603F5101TS: as R37 on sheet MICROSD CARD
SW1 SW2 = B3U-1000P: 12V 2.5mm Round Button 3mm SPST 50mA SMD,3x2.5mm Tactile Switches ROHS
U2 = JC-ESP32P4-M3